# EasyEDA Pro project 14届省.epro

# Schematic B1

## Sheets
1 ETH: Create Date: 2024-04-08; Page Name: ETH; Project Name: Project; Schematic Name: B1; Update Date: 2024-04-08
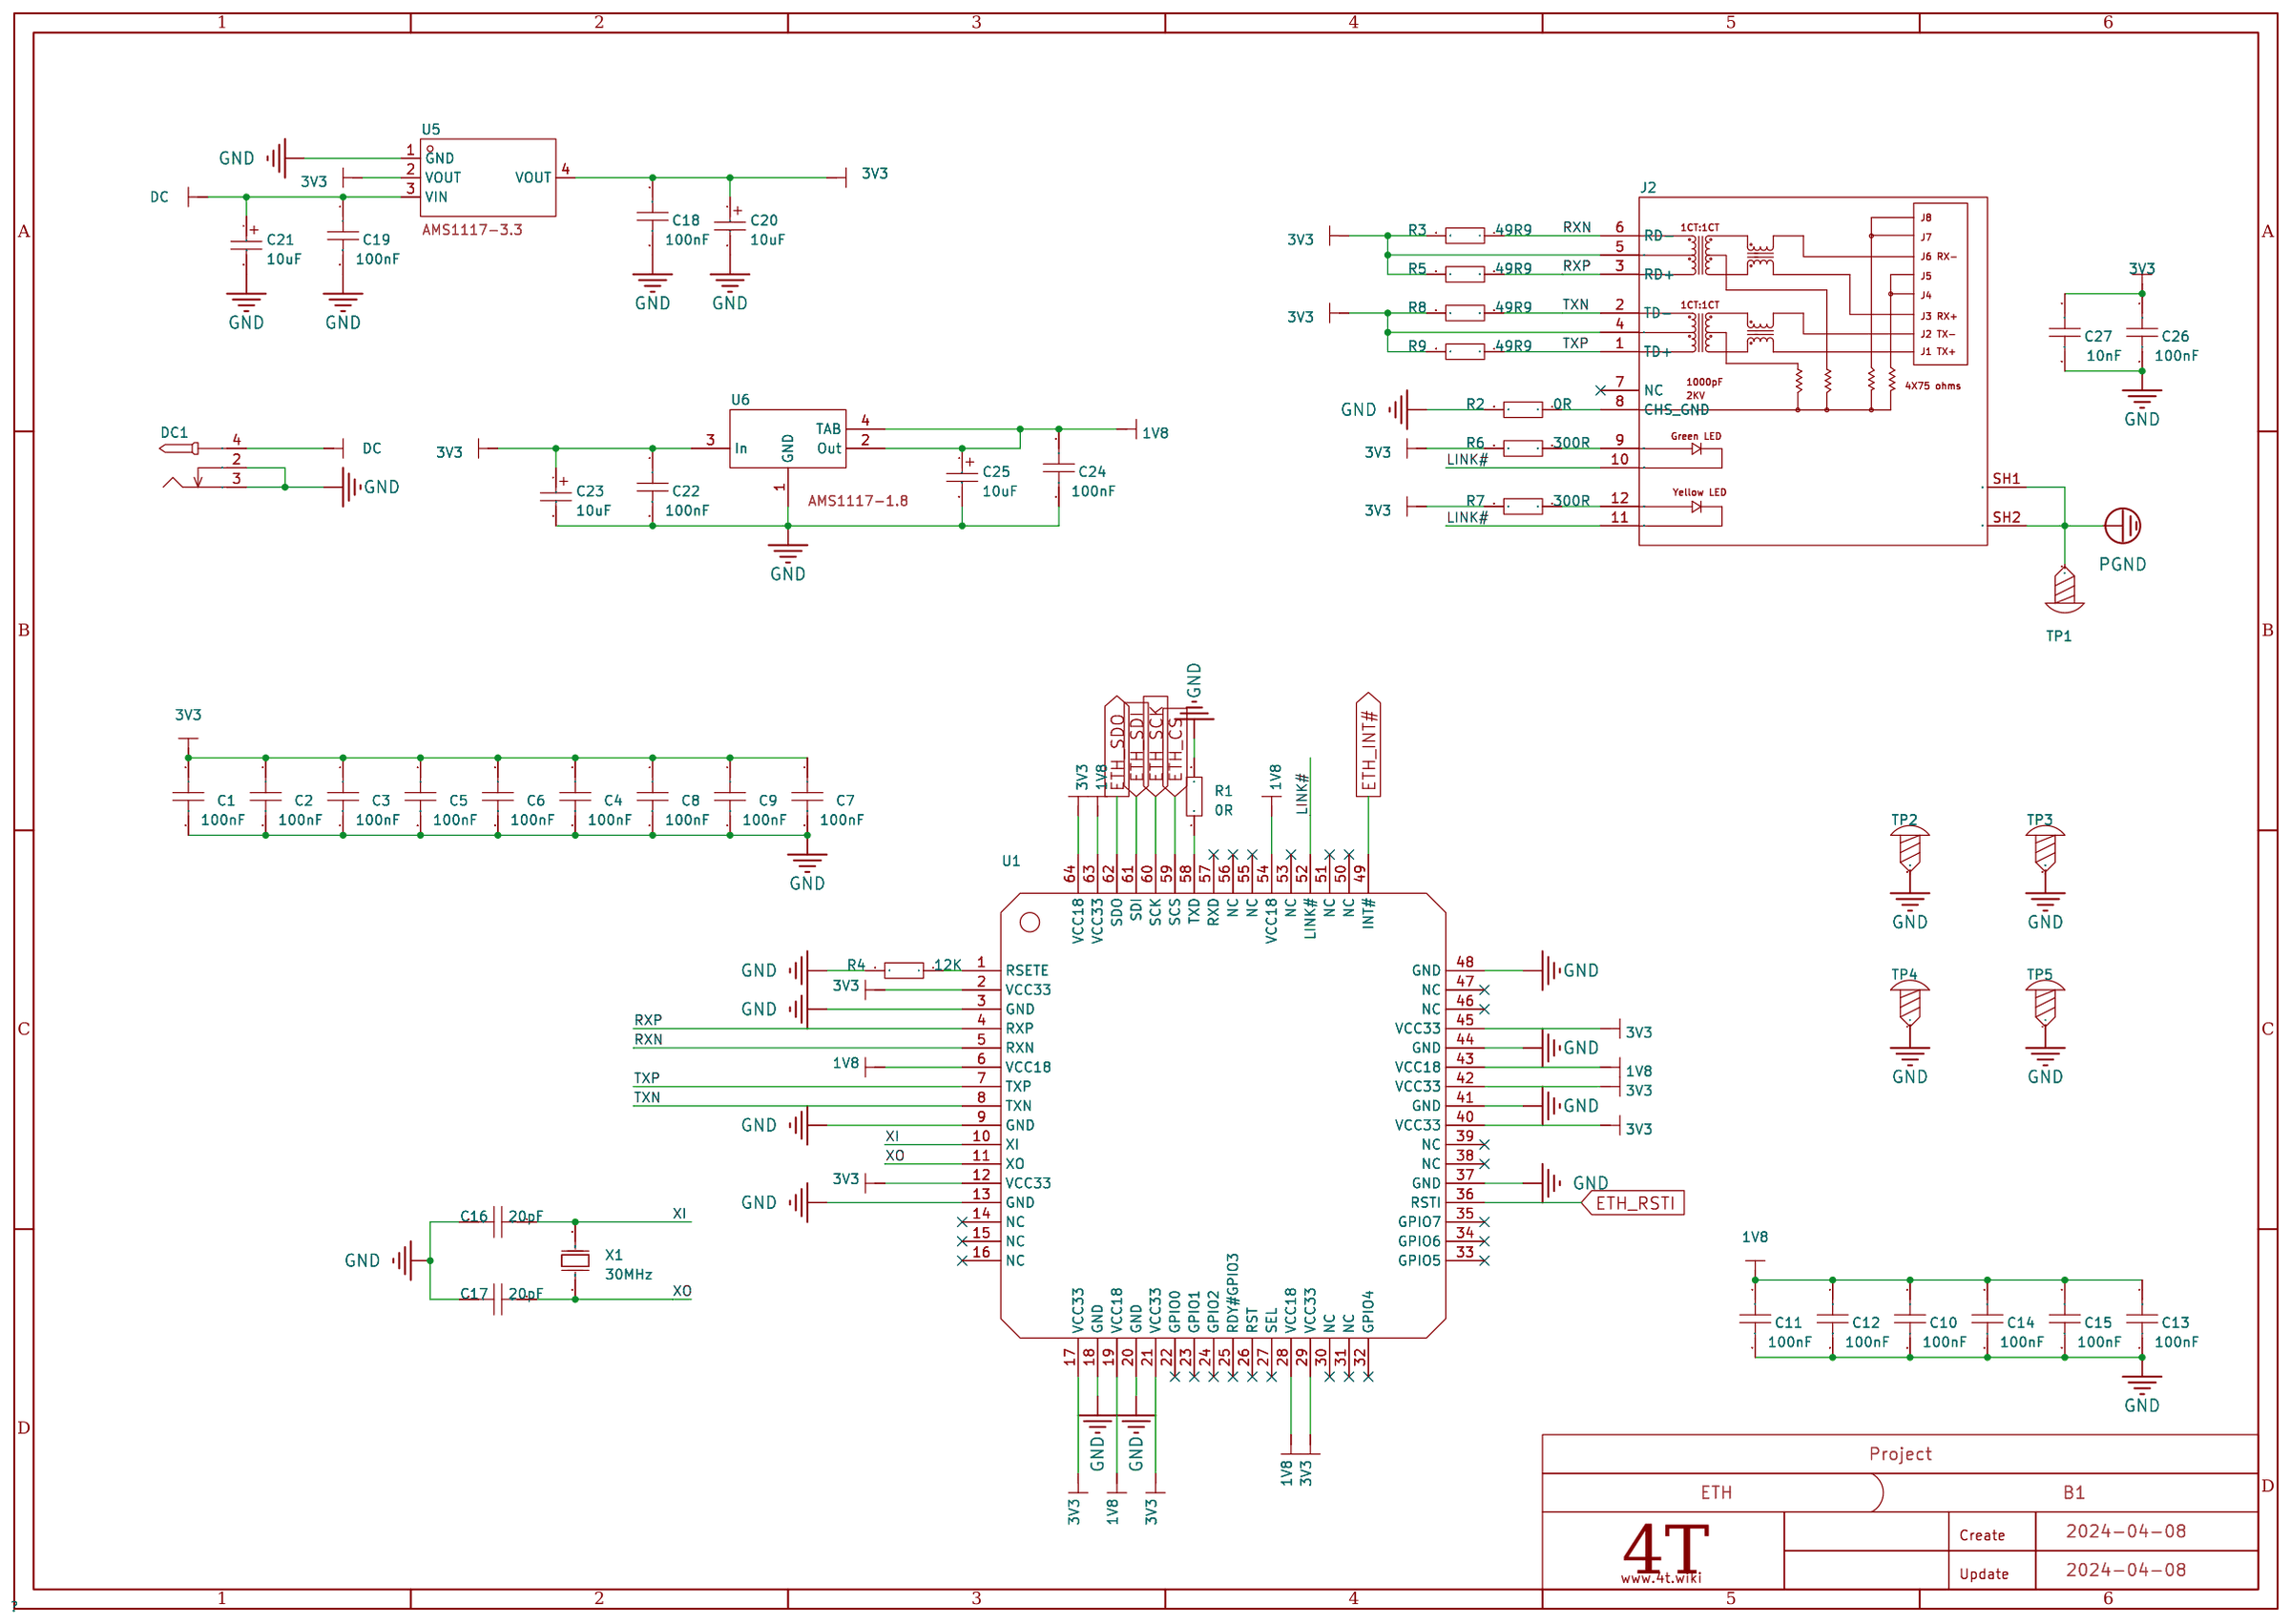
[diagram p0: ETH]
2 MP: Page Name: MP; Update Date: 2024-04-10
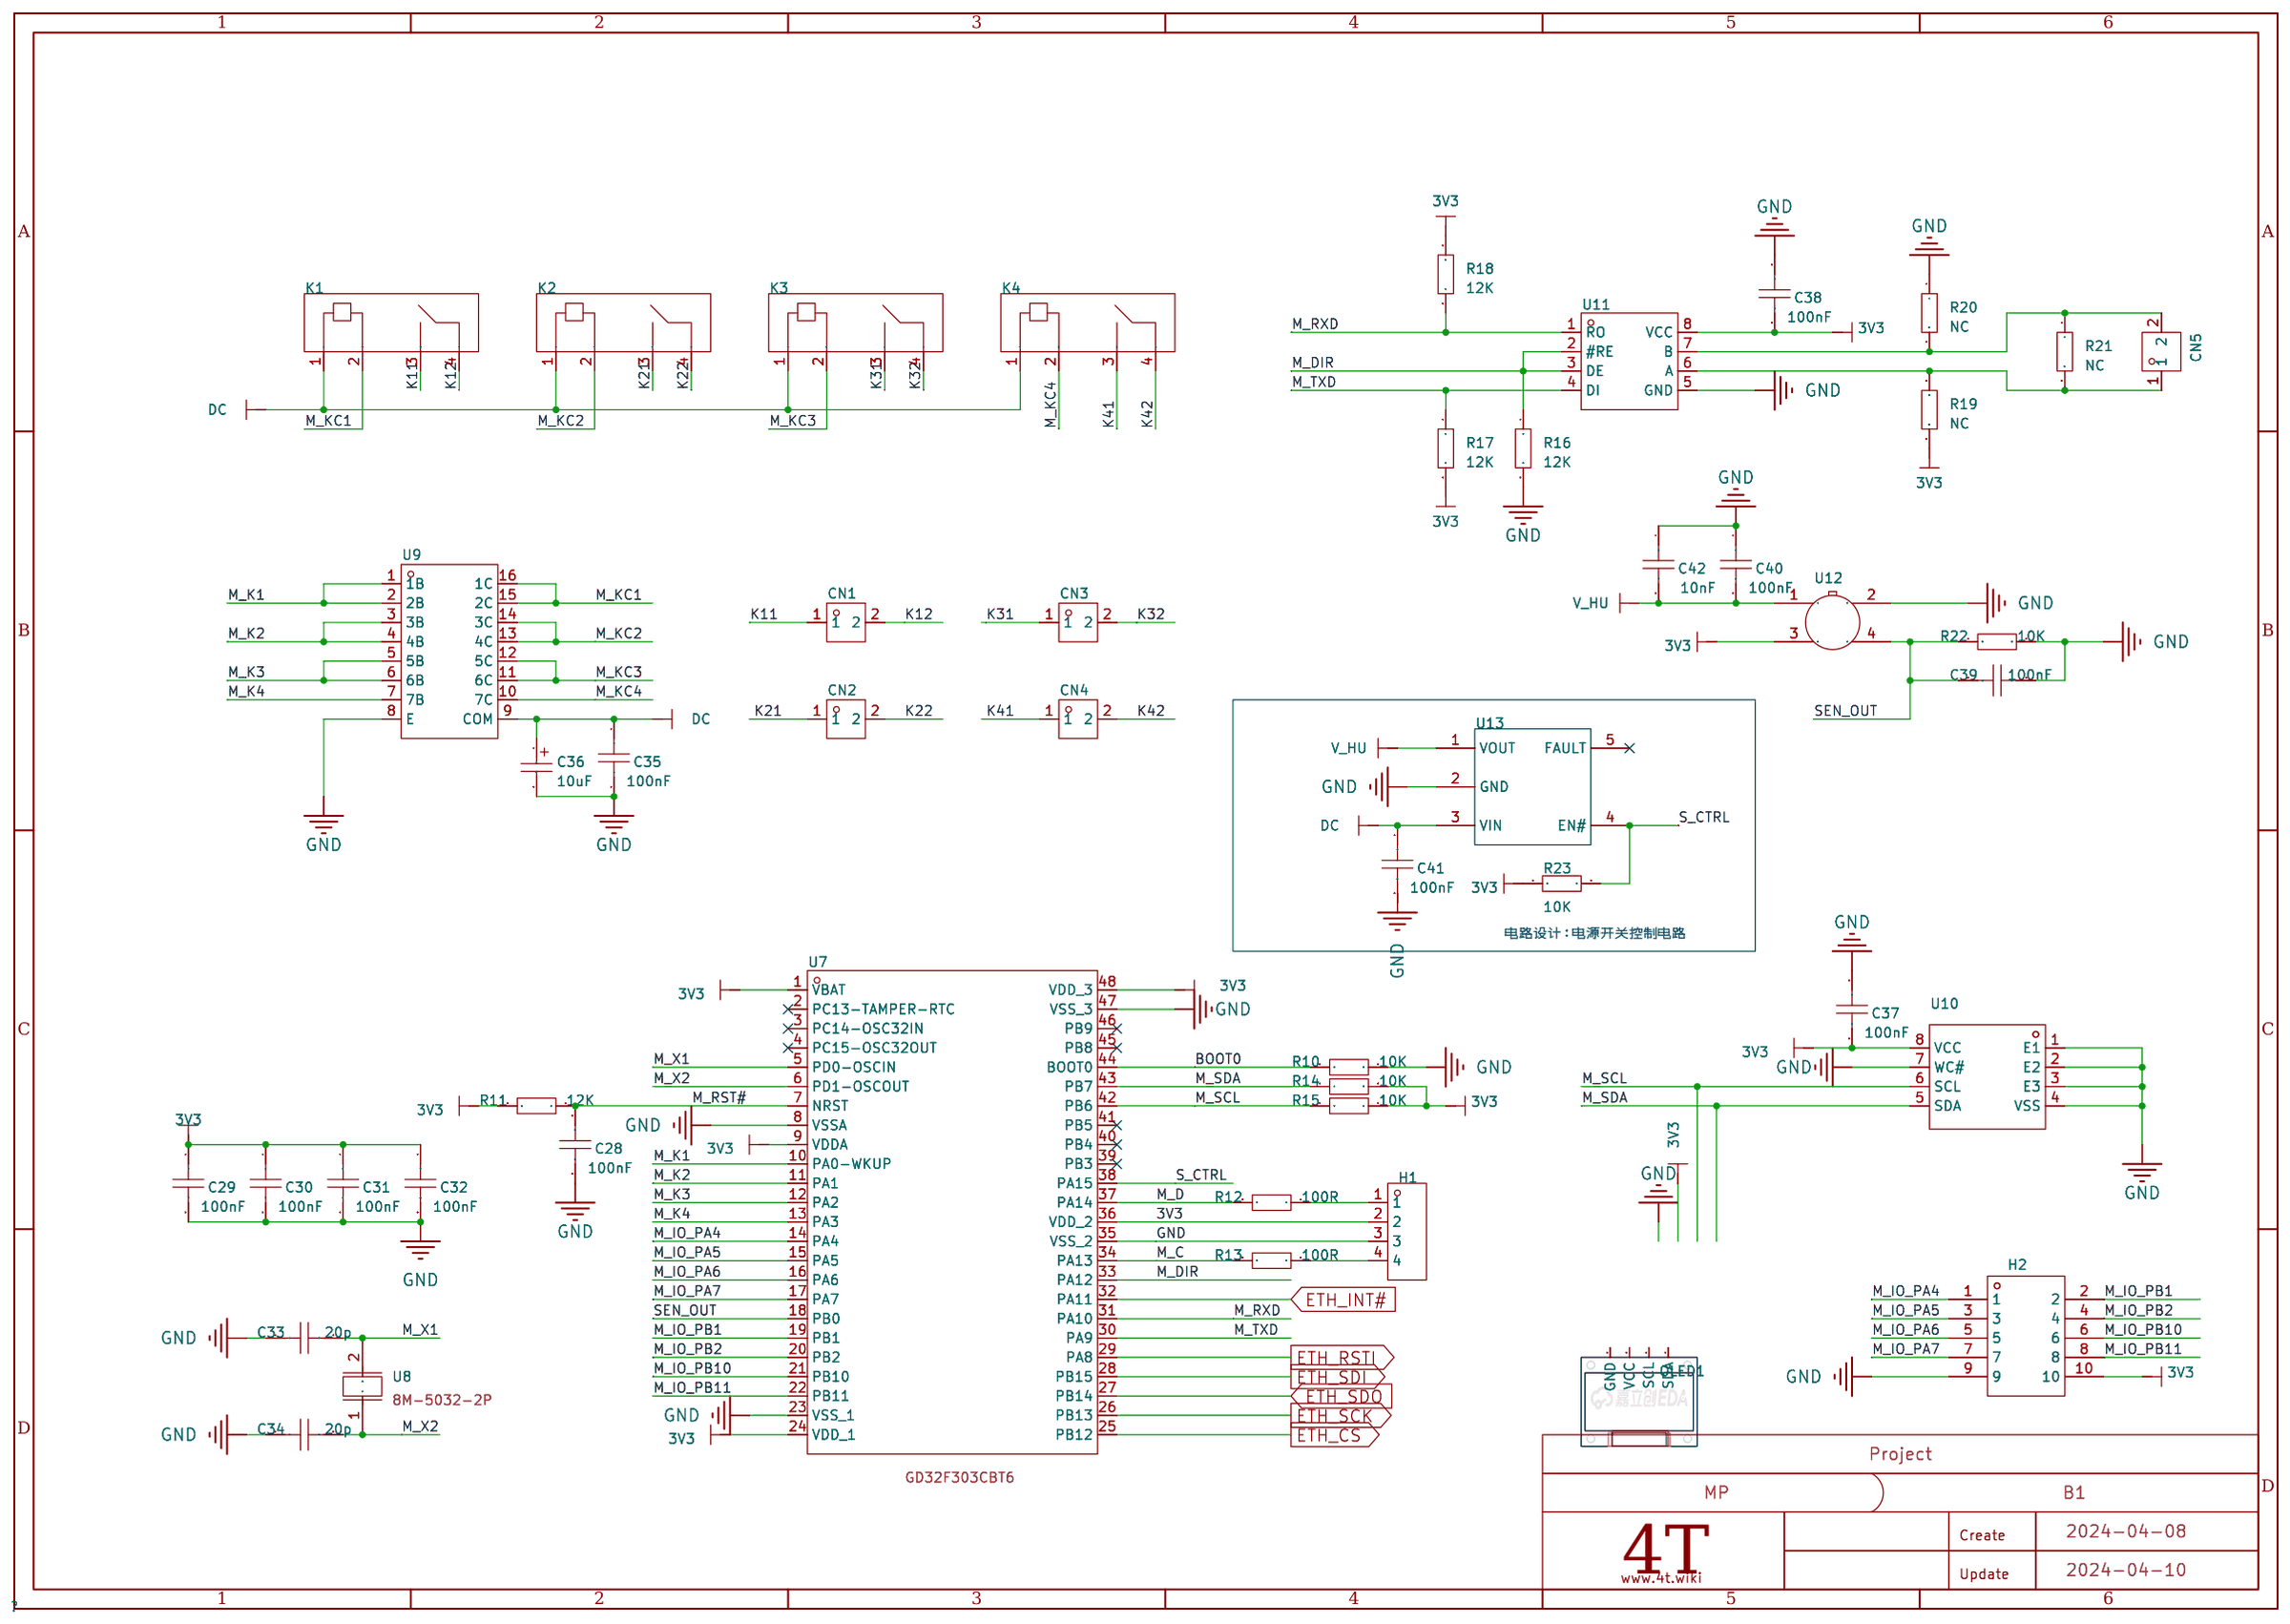
[diagram p1: MP]

## Parts
sheet ETH
C1  100nF  [C0805]
C2  100nF  [C0805]
C3  100nF  [C0805]
C4  100nF  [C0805]
C5  100nF  [C0805]
C6  100nF  [C0805]
C7  100nF  [C0805]
C8  100nF  [C0805]
C9  100nF  [C0805]
C10  100nF  [C0805]
C11  100nF  [C0805]
C12  100nF  [C0805]
C13  100nF  [C0805]
C14  100nF  [C0805]
C15  100nF  [C0805]
C16  20pF  [C0805]
C17  20pF  [C0805]
C18  100nF  [C0805]
C19  100nF  [C0805]
C20  10uF  [C_Ele_SMD_3x5.4mm]
C21  10uF  [C_Ele_SMD_3x5.4mm]
C22  100nF  [C0805]
C23  10uF  [C_Ele_SMD_3x5.4mm]
C24  100nF  [C0805]
C25  10uF  [C_Ele_SMD_3x5.4mm]
C26  100nF  [C0805]
C27  10nF  [C0805]
DC1  -  [DC-2.0]
J2  HY911105AE  [RJ45-TH_HR911105A]
R1  0R  [R0805]
R2  0R  [R0805]
R3  49R9  [R0805]
R4  12K  [R0805]
R5  49R9  [R0805]
R6  300R  [R0805]
R7  300R  [R0805]
R8  49R9  [R0805]
R9  49R9  [R0805]
TP1  -  [M3螺丝]
TP2  -  [M2螺丝]
TP3  -  [M2螺丝]
TP4  -  [M2螺丝]
TP5  -  [M2螺丝]
U1  CH395Q  [LQFP-64_L10.0-W10.0-P0.50-LS12.0-BL]
U5  AMS1117-3.3  [SOT-223-3_L6.5-W3.4-P2.30-LS7.0-BR]
U6  AMS1117-1.8  [SOT-223-4_L6.5-W3.5-P2.30-LS7.0-BR]
X1  30MHz  [OSC-SMD_L5.0-W3.2]
sheet MP
C28  100nF  [C0805]
C29  100nF  [C0805]
C30  100nF  [C0805]
C31  100nF  [C0805]
C32  100nF  [C0805]
C33  20p  [C0805]
C34  20p  [C0805]
C35  100nF  [C0805]
C36  10uF  [C_Ele_SMD_3x5.4mm]
C37  100nF  [C0805]
C38  100nF  [C0805]
C39  100nF  [C0805]
C40  100nF  [C0805]
C41  100nF  [C0805]
C42  10nF  [C0805]
CN1  KF128L-5.08-2P 蓝色  [TH_KF128L-5.08-2P]
CN2  KF128L-5.08-2P 蓝色  [TH_KF128L-5.08-2P]
CN3  KF128L-5.08-2P 蓝色  [TH_KF128L-5.08-2P]
CN4  KF128L-5.08-2P 蓝色  [TH_KF128L-5.08-2P]
CN5  KF128L-5.08-2P 蓝色  [TH_KF128L-5.08-2P]
H1  -  [HDR-TH_4P-P2.54-V-F]
H2  -  [HDR-TH_10P-P2.54-V-M-R2-C5-S2.54]
K1  HF49FD/012-1H12  [RELAY-TH_HF49FD-XXX-1H12-XXX]
K2  HF49FD/012-1H12  [RELAY-TH_HF49FD-XXX-1H12-XXX]
K3  HF49FD/012-1H12  [RELAY-TH_HF49FD-XXX-1H12-XXX]
K4  HF49FD/012-1H12  [RELAY-TH_HF49FD-XXX-1H12-XXX]
OLED1  -  [0.96OLED_4P]
R10  10K  [R0805]
R11  12K  [R0805]
R12  100R  [R0805]
R13  100R  [R0805]
R14  10K  [R0805]
R15  10K  [R0805]
R16  12K  [R0805]
R17  12K  [R0805]
R18  12K  [R0805]
R19  NC  [R0805]
R20  NC  [R0805]
R21  NC  [R0805]
R22  10K  [R0805]
R23  10K  [R0805]
U7  GD32F303CBT6  [LQFP-48_L7.0-W7.0-P0.50-LS9.0-BL]
U8  8M-5032-2P  [CRYSTAL-SMD_L5.0-W3.2]
U9  ULN2003  [SOIC-16_L9.9-W3.9-P1.27-LS6.0-BL]
U10  M24C02-WMN6TP  [SOIC-8_L4.9-W3.9-P1.27-LS6.0-BL]
U11  MAX3485ESA  [SOP-8_L5.0-W4.0-P1.27-LS6.0-BL]
U12  MP-2  [SENSOR-TH_MP-5]
U13  -  [SOT_PDS]

## Library data of the parts
C1-C19 C22 C24 C26-C35 C37-C42 = CAP_0603: Supplier Footprint: 0603
C20 C21 C23 C25 C36 = C_Ele_SMD_3x5.4mm: Supplier Footprint: SMD,3x5.4mm
DC1 = DC-005_2.0: Supplier Footprint: 插件
J2 = HY911105AE: 连接器类型:RJ插座;USOC代码:RJ45;端口数量:1;等级:-;屏蔽:-;LED:-;; LCSC Part Name: RJ45 带变压器; Supplier Part: C69427; Manufacturer: HANRUN(汉仁); Supplier Footprint: 插件; JLCPCB Part Class: 扩展库; Datasheet: https://atta.szlcsc.com/upload/public/pdf/source/20160507/1462613611469.pdf; Supplier: LCSC; Connector Type: RJ插座; USOC Codes: RJ45; Number of Ports: 1
R1-R23 = Res_0805: Supplier Footprint: 0805
TP1 = M3螺丝: Supplier Footprint: 插件
TP2-TP5 = M2螺丝: Supplier Footprint: 插件
U1 = CH395Q: 应用功能:以太网控制器;通道数:-;接口类型:Parallel, SPI, UART;电源电压:1.65V~3.6V;电源电流:90mA;; Supplier Part: C87390; Manufacturer: WCH(南京沁恒); Supplier Footprint: LQFP-64(10x10); JLCPCB Part Class: 扩展库; Datasheet: https://atta.szlcsc.com/upload/public/pdf/source/20200903/C87390_2BA27438C515B4B897A780BE99160E01.pdf; Supplier: LCSC; Application Function: 以太网控制器; Interface: Parallel, SPI, UART; Supply Voltage: 1.65V~3.6V; Supply Current: 90mA
U5 = AMS1117-3.3_C6186: 输出类型:固定;输出极性:正;输出通道数:1;最大输入电压:-;输出电压:3.3V;压差:1.3V@(800mA);静态电流(地电流):-;输出电流:1A;电源纹波抑制比(PSRR):72dB@(120Hz);噪声:-;特性:-;工作温度:-;; LCSC Part Name: 正 Vout=3.3V 1A 72dB@(120Hz); Supplier Part: C6186; Manufacturer: AMS; Supplier Footprint: SOT-223-3; JLCPCB Part Class: 基础库; Datasheet: https://atta.szlcsc.com/upload/public/pdf/source/20180727/C6186_7A095716F0823C02F1997A905E26C086.pdf; Supplier: LCSC; Output Type: 固定; Output Polarity: 正; Number of Outputs: 1; Output Voltage: 3.3V; Dropout Voltage: 1.3V@(800mA); Output Current: 1A; Power Supply Rejection Ratio (PSRR): 72dB@(120Hz)
U6 = AMS1117-1.8_C6185: 输出类型:固定;输出极性:正;输出通道数:1;最大输入电压:15V;输出电压:1.8V~1.8V;压差:1.3V@(1A);输出电流:1A;电源纹波抑制比(PSRR):75dB@(120Hz);; LCSC Part Name: 正 Vin=15V Vout=1.8V~1.8V 1A 75dB@(120Hz); Supplier Part: C6185; Manufacturer: AMS; Supplier Footprint: SOT-223-4; JLCPCB Part Class: 扩展库; Datasheet: https://atta.szlcsc.com/upload/public/pdf/source/20180727/C6186_7A095716F0823C02F1997A905E26C086.pdf; Supplier: LCSC; Output Type: 固定; Output Polarity: 正; Number of Outputs: 1; Maximum Input Voltage: 15V; Output Voltage: 1.8V~1.8V; Dropout Voltage: 1.3V@(1A); Output Current: 1A; Power Supply Rejection Ratio (PSRR): 75dB@(120Hz)
X1 = X503230MSB2GI: 晶振类型:贴片无源晶振;频率:30MHz;频率公差:±10ppm;频率稳定度:±50ppm;负载电容:20pF;工作温度:-40℃~+85℃;; LCSC Part Name: YSX530GA 30MHz ±10ppm 20pF; Supplier Part: C112563; Manufacturer: YXC(扬兴晶振); Supplier Footprint: SMD5032-2P; JLCPCB Part Class: 扩展库; Datasheet: https://atta.szlcsc.com/upload/public/pdf/source/20210329/C112559_847D3CACBA33ACCEB57DEA3AEBB187A1.pdf; Supplier: LCSC; Crystal Type: 贴片无源晶振; Frequency Tolerance: ±10ppm; Frequency Stability: ±50ppm; Load Capacitance: 20pF; Operating Temperature: -40℃~+85℃
CN1-CN5 = KF128L-5.08-2P 蓝色: Supplier Part: C2916931; Supplier Footprint: 5.08-2P; JLCPCB Part Class: 扩展库; Supplier: LCSC
H1 = HDR-F_2.54_1x4P: Supplier Part: C2718488; Supplier Footprint: 插件
H2 = HDR-M_2.54_2x5: Supplier Part: C124387; Supplier Footprint: 插件,P=2.54mm
K1-K4 = HF49FD/012-1H12: 线圈电压:12V;线圈类型:非极化-单线圈;触点形式:一组常开:1A(单刀单掷-常开);最大切换电流:5A;触点材料:AgNi;; LCSC Part Name: 宏发继电器; Supplier Part: C399491; Manufacturer: HF(宏发); Supplier Footprint: SIP-4; JLCPCB Part Class: 扩展库; Datasheet: https://atta.szlcsc.com/upload/public/pdf/source/20190620/C399491_B2190B02DDD565265172868420E7880D.pdf; Supplier: LCSC; Coil Voltage: 12V; Coil Type: 非极化-单线圈; Pin Number: 4; Contact Form: 一组常开:1A(单刀单掷-常开); Maximum Switching Current: 5A; Maximum Switching Voltage: 250V@AC；30V@DC; Coil Rated Power: 120mW; Contact Rating: 5A@30VDC；5A@250VAC; Coil Resistance: 1.2kΩ; Operate Time: 10ms; Release Time: 5ms; Contact Resistance: 100mΩ; Contact Material: AgNi; Operating Temperature: -40℃~+85℃
OLED1 = 0.96OLED模块_4P: Supplier Footprint: 插件
U7 = GD32F303CBT6_C3013779: CPU内核:ARM Cortex-M4;CPU最大主频:120MHz;工作电压范围:-;程序存储容量:128KB;RAM总容量:32KB;EEPROM/数据 FLASH容量:128KB;GPIO端口数量:37;ADC(位数):12bit;DAC(位数):12bit;(E)PWM(位数):-;8位Timer数量:-;16位Timer数量:7;32位Timer数量:-;CAN路数:1;U(S)ART路数:3;I2C路数:2;I2S路数:2;(Q)SPI路数:3;外设/功能:看门狗；RTC实时时钟;内部振荡器:; LCSC Part Name: ARM Cortex-M4 120MHz; Supplier Part: C3013779; Manufacturer: GigaDevice(兆易创新); Supplier Footprint: LQFP-48(7x7); JLCPCB Part Class: 扩展库; Datasheet: https://atta.szlcsc.com/upload/public/pdf/source/20220624/E1A57ED816B162D6D1424864911A792F.pdf; Supplier: LCSC; CPU Core: ARM Cortex-M4; CPU Maximum Speed: 120MHz; Program Storage Size: 128KB; Program Memory Type: FLASH; RAM Size: 32KB; EEPROM: 128KB; GPIO Ports Number: 37; ADC (Bit): 12bit; DAC (Bit): 12bit; 16Bit Timer: 7; CAN: 1; UART/USART: 3; I2C: 2; I2S: 2; SPI: 3; Peripheral/Function: 看门狗；RTC实时时钟; Watchdog: 有; Real-Time Clock: 有
U8 = 8M-5032-2P: Supplier Part: C9900017580; Supplier Footprint: 8MHz; JLCPCB Part Class: 扩展库; Supplier: LCSC
U9 = ULN2003: 开态输入电压(VI(on)@Vce,Ic):3V@2V,300mA;集射极饱和压降(VCE(sat)@Ii,Ic):1.2V@500uA,350mA;输出漏电流(Icex@Vce):50uA@50V;开态输入电流(Ii@Vi):-;关态输入电流(Ii(off)@Vce,Ic):65uA@50V,500uA;嵌位二极管漏电流(IR@VR):50uA@50V;嵌位二极管正向压降(VF@IF):1.7V@350mA;输入电容(Ci):15pF;工作温度:-20℃~+85℃;; Supplier Part: C688859; Manufacturer: IDCHIP(英锐芯); Supplier Footprint: SOIC-16; JLCPCB Part Class: 扩展库; Datasheet: https://atta.szlcsc.com/upload/public/pdf/source/20210302/C688859_5C67C6CBB0EA78EF92AFC966B53E1AD0.pdf; Supplier: LCSC; ON-state input   voltage(VI(on)@Vce,Ic): 3V@2V,300mA; Collector-emitter   saturation voltage (VCE(sat)@Ii,Ic): 1.2V@500uA,350mA; Output leakage current (Icex@Vce): 50uA@50V; Off-state input current (Ii(off)@Vce,Ic): 65uA@50V,500uA; Clamp Diode Leakage Current (IR@VR): 50uA@50V; Clamp Diode Forward Voltage (VF@IF): 1.7V@350mA; Input Capacitance (Ci): 15pF; Operating Temperature: -20℃~+85℃
U10 = M24C02-WMN6TP: 2-Kbit(256 x 8bit)，I2C接口，工作电压：2.5V to 5.5V; Supplier Part: C7562; Manufacturer: ST(意法半导体); Supplier Footprint: SOIC-8; JLCPCB Part Class: 基础库; Datasheet: https://atta.szlcsc.com/upload/public/pdf/source/20140724/1457707167301.pdf; Supplier: LCSC
U11 = MAX3485ESA: Supplier Part: C668204; Manufacturer: UMW(广东友台半导体); Supplier Footprint: SOP-8; JLCPCB Part Class: 扩展库; Datasheet: https://atta.szlcsc.com/upload/public/pdf/source/20221009/BC018EFD0F414E24649E284F574E449C.pdf; Supplier: LCSC
U12 = MP-2: Supplier Part: C242497; Manufacturer: Winsen(炜盛); Supplier Footprint: 插件; JLCPCB Part Class: 扩展库; Datasheet: https://atta.szlcsc.com/upload/public/pdf/source/20180704/C242497_B8D2418C2743DA3210851F2FB82DA8BD.pdf; Supplier: LCSC
U13 = PDS

## Nets
1V8: C10.1 C11.1 C12.1 C13.1 C14.1 C15.1 C24.1 C25.1 U1.6(VCC18) U1.19(VCC18) U1.28(VCC18) U1.43(VCC18) U1.54(VCC18) U1.63(VCC33) U6.2(Out) U6.4(TAB)
3V3: C1.1 C2.1 C3.1 C4.1 C5.1 C6.1 C7.1 C8.1 C9.1 C18.1 C20.1 C22.1 C23.1 C26.1 C27.1 C29.1 C30.1 C31.1 C32.1 C37.2 C38.2 H1.2 H2.10 J2.4 J2.5 R3.2 R5.2 R6.2 R7.2 R8.2 R9.2 R11.2 R14.2 R15.1 R17.2 R18.1 R19.2 R23.1 U1.2(VCC33) U1.12(VCC33) U1.17(VCC33) U1.21(VCC33) U1.29(VCC33) U1.40(VCC33) U1.42(VCC33) U1.45(VCC33) U1.64(VCC18) U5.2(VOUT) U5.4(VOUT) U6.3(In) U7.1(VBAT) U7.9(VDDA) U7.24(VDD_1) U7.36(VDD_2) U7.48(VDD_3) U10.8(VCC) U11.8(VCC) U12.3
GND: C1.2 C2.2 C3.2 C4.2 C5.2 C6.2 C7.2 C8.2 C9.2 C10.2 C11.2 C12.2 C13.2 C14.2 C15.2 C16.1 C17.1 C18.2 C19.2 C20.2 C21.2 C22.2 C23.2 C24.2 C25.2 C26.2 C27.2 C28.2 C29.2 C30.2 C31.2 C32.2 C33.1 C34.1 C35.2 C36.2 C37.1 C38.1 C39.2 C40.1 C41.2 C42.1 DC1.2 DC1.3 H1.3 H2.9 R1.2 R2.2 R4.2 R10.1 R16.2 R20.1 R22.2 TP2.1 TP3.1 TP4.1 TP5.1 U1.3(GND) U1.9(GND) U1.13(GND) U1.18(GND) U1.20(GND) U1.37(GND) U1.41(GND) U1.44(GND) U1.48(GND) U5.1(GND) U6.1(GND) U7.8(VSSA) U7.23(VSS_1) U7.35(VSS_2) U7.47(VSS_3) U9.8(E) U10.1(E1) U10.2(E2) U10.3(E3) U10.4(VSS) U10.7(WC#) U11.5(GND) U12.2 U13.2(GND)
PGND: J2.SH1 J2.SH2 TP1.1
BOOT0: R10.2 U7.44(BOOT0)
DC: C19.1 C21.1 C35.1 C36.1 C41.1 DC1.4 K1.1 K2.1 K3.1 K4.1 U5.3(VIN) U9.9(COM) U13.3(VIN)
ETH_CS: U1.59(SCS) U7.25(PB12)
ETH_INT#: U1.49(INT#) U7.32(PA11)
ETH_RSTI: U1.36(RSTI) U7.29(PA8)
ETH_SCK: U1.60(SCK) U7.26(PB13)
ETH_SDI: U1.61(SDI) U7.28(PB15)
ETH_SDO: U1.62(SDO) U7.27(PB14)
K11: CN1.1 K1.3
K12: CN1.2 K1.4
K21: CN2.1 K2.3
K22: CN2.2 K2.4
K31: CN3.1 K3.3
K32: CN3.2 K3.4
K41: CN4.1 K4.3
K42: CN4.2 K4.4
LINK#: J2.10 J2.11 U1.52(LINK#)
M_C: R13.2 U7.34(PA13)
M_D: R12.2 U7.37(PA14)
M_DIR: R16.1 U7.33(PA12) U11.2(#RE) U11.3(DE)
M_IO_PA4: H2.1 U7.14(PA4)
M_IO_PA5: H2.3 U7.15(PA5)
M_IO_PA6: H2.5 U7.16(PA6)
M_IO_PA7: H2.7 U7.17(PA7)
M_IO_PB1: H2.2 U7.19(PB1)
M_IO_PB2: H2.4 U7.20(PB2)
M_IO_PB10: H2.6 U7.21(PB10)
M_IO_PB11: H2.8 U7.22(PB11)
M_K1: U7.10(PA0-WKUP) U9.1(1B) U9.2(2B)
M_K2: U7.11(PA1) U9.3(3B) U9.4(4B)
M_K3: U7.12(PA2) U9.5(5B) U9.6(6B)
M_K4: U7.13(PA3) U9.7(7B)
M_KC1: K1.2 U9.15(2C) U9.16(1C)
M_KC2: K2.2 U9.13(4C) U9.14(3C)
M_KC3: K3.2 U9.11(6C) U9.12(5C)
M_KC4: K4.2 U9.10(7C)
M_RST#: C28.1 R11.1 U7.7(NRST)
M_RXD: R18.2 U7.31(PA10) U11.1(RO)
M_SCL: R15.2 U7.42(PB6) U10.6(SCL)
M_SDA: R14.1 U7.43(PB7) U10.5(SDA)
M_TXD: R17.1 U7.30(PA9) U11.4(DI)
M_X1: C33.2 U7.5(PD0-OSCIN) U8.2
M_X2: C34.2 U7.6(PD1-OSCOUT) U8.1
RXN: J2.6(RD-) R3.1 U1.5(RXN)
RXP: J2.3(RD+) R5.1 U1.4(RXP)
S_CTRL: R23.2 U7.38(PA15) U13.4(EN#)
SEN_OUT: C39.1 R22.1 U7.18(PB0) U12.4
TXN: J2.2(TD-) R8.1 U1.8(TXN)
TXP: J2.1(TD+) R9.1 U1.7(TXP)
V_HU: C40.2 C42.2 U12.1 U13.1(VOUT)
XI: C16.2 U1.10(XI) X1.2(OSC2)
XO: C17.2 U1.11(XO) X1.1(OSC1)
$1N6890: R4.1 U1.1(RSETE)
$1N7627: R1.1 U1.58(TXD)
$1N10654: J2.8(CHS GND) R2.1
$1N10919: J2.12 R7.1
$1N10952: J2.9 R6.1
$2N5291: H1.1 R12.1
$2N5344: H1.4 R13.1
$2N14954: CN5.2 R20.2 R21.1 U11.7(B)
$2N14989: CN5.1 R19.1 R21.2 U11.6(A)

Not connected (* = marked no-connect by the designer): J2 7(NC)*; OLED1 1(GND) 2(VCC) 3(SCL) 4(SDA); U1 14(NC)* 15(NC)* 16(NC)* 22(GPIO0)* 23(GPIO1)* 24(GPIO2)* 25(RDY#GPIO3)* 26(RST)* 27(SEL)* 30(NC)* 31(NC)* 32(GPIO4)* 33(GPIO5)* 34(GPIO6)* 35(GPIO7)* 38(NC)* 39(NC)* 46(NC)* 47(NC)* 50(NC)* 51(NC)* 53(NC)* 55(NC)* 56(NC)* 57(RXD)*; U7 2(PC13-TAMPER-RTC)* 3(PC14-OSC32IN)* 4(PC15-OSC32OUT)* 39(PB3)* 40(PB4)* 41(PB5)* 45(PB8)* 46(PB9)*; U13 5(FAULT)*

## Notes on the sheets
sheet 2
- 电路设计：电源开关控制电路

# Board B1
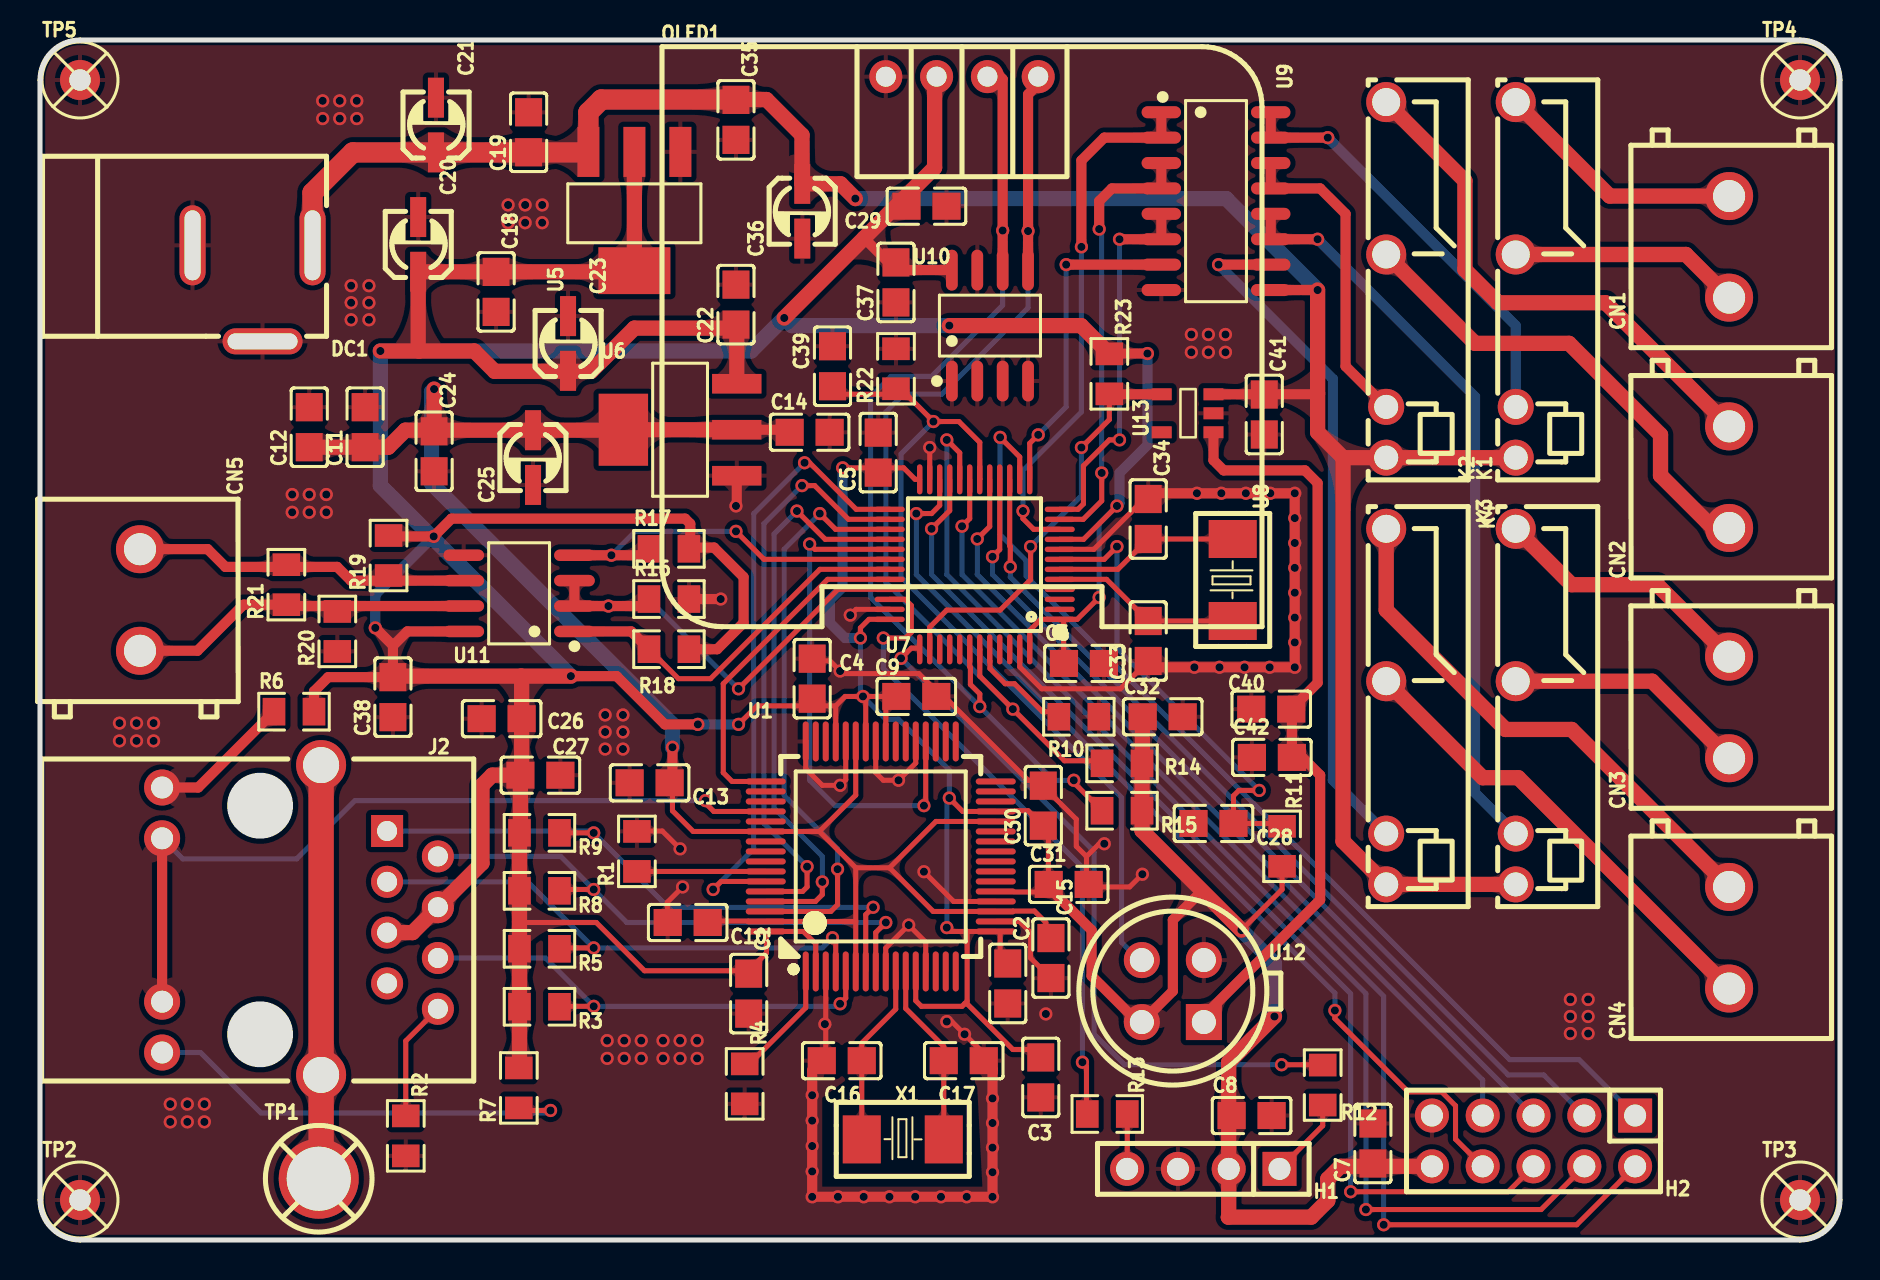
[diagram p2: board, top side]
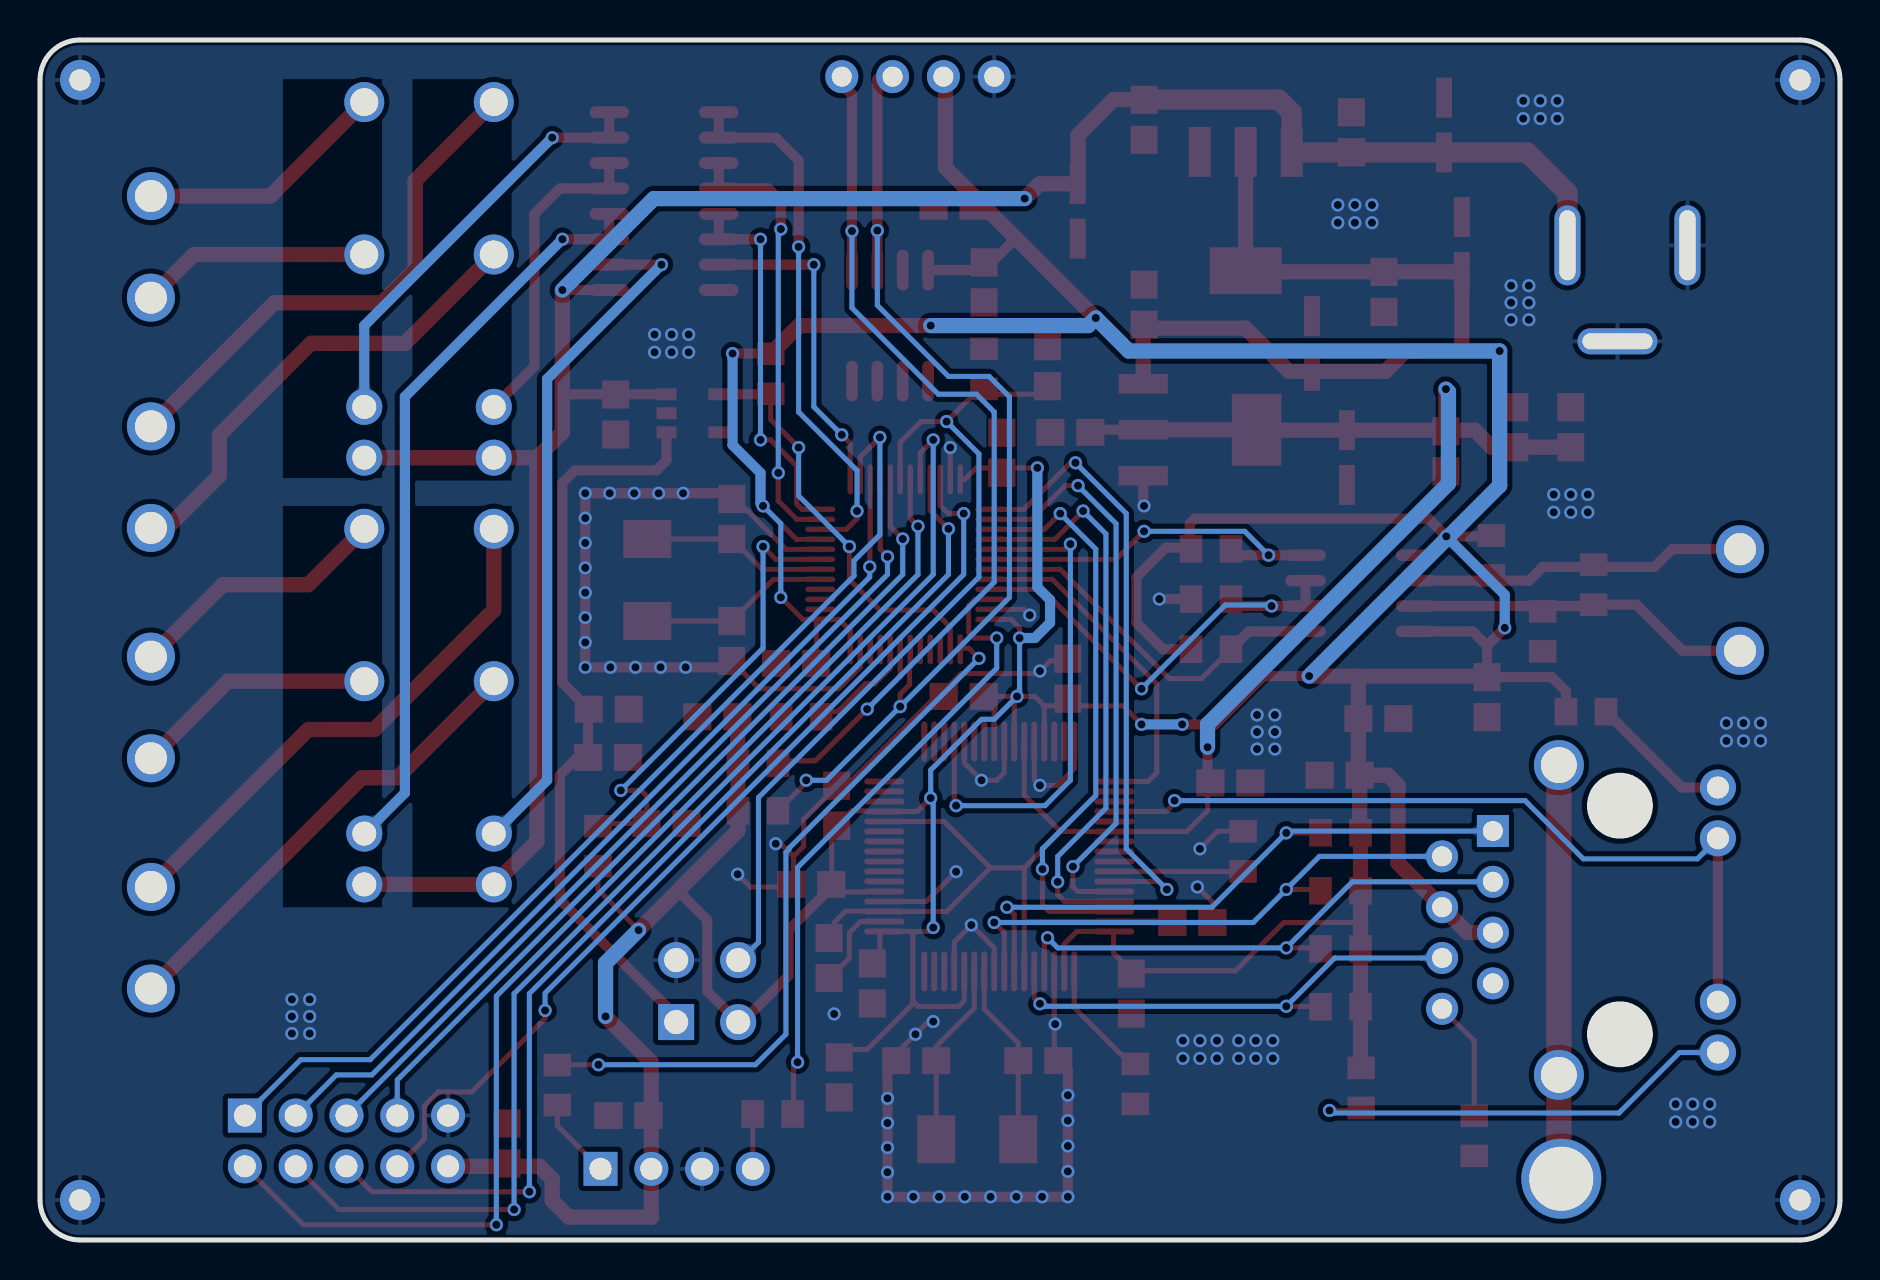
[diagram p3: board, bottom side, seen from below]

Outline 90 x 60 mm; copper layers: Top Layer, Bottom Layer. Coordinates in mm from the lower left corner of the outline.
Outline path: 0,58 0,2 arc(0.59,0.59) 2,0 88,0 arc(89.41,0.59) 90,2 90,58 arc(89.41,59.41) 88,60 2,60 arc(0.59,59.41) 0,58
Stack: Top Layer 0.035mm / Dielectric1 1.51mm FR4 er 4.5 / Bottom Layer 0.035mm

## Design rules (mm)
net XO: DP1
net XI: DP1
net M_X1: DP2
net M_X2: DP2
template: 用户自定义配置
spacing safeClearance (default): track to track 0.203, other pairs 0.152 to 0.3
track width trackWidth (default): min 0.254, default 0.254, max 2.54
differential pair differentialPair (default): width min 0.127, default 0.254, max 2.54; gap min 0.152, default 0.152
via viaSize (default): diameter min 0.635, default 0.66, max 10; hole min 0.381, default 0.406, max 5.999

## Placement (name value [footprint] x y rotation side)
C1  100nF  [C0805]  35.43 12.32 270 top
C2  100nF  [C0805]  48.39 12.83 270 top
C3  100nF  [C0805]  50.04 8.13 270 top
C4  100nF  [C0805]  38.61 28.07 90 top
C5  100nF  [C0805]  41.91 39.37 90 top
C6  100nF  [C0805]  52.2 28.83 0 top
C7  100nF  [C0805]  66.64 4.83 90 top
C8  100nF  [C0805]  60.58 6.22 0 top
C9  100nF  [C0805]  43.81 27.18 0 top
C10  100nF  [C0805]  32.38 15.88 180 top
C11  100nF  [C0805]  16.26 40.64 90 top
C12  100nF  [C0805]  13.46 40.64 90 top
C13  100nF  [C0805]  30.48 22.86 180 top
C14  100nF  [C0805]  38.48 40.39 0 top
C15  100nF  [C0805]  50.55 14.1 270 top
C16  20pF  [C0805]  40.09 8.97 0 top
C17  20pF  [C0805]  46.19 8.97 180 top
C18  100nF  [C0805]  22.81 47.41 270 top
C19  100nF  [C0805]  24.43 55.39 90 top
C20  10uF  [C_Ele_SMD_3x5.4mm]  18.92 49.78 270 top
C21  10uF  [C_Ele_SMD_3x5.4mm]  19.81 55.75 270 top
C22  100nF  [C0805]  34.8 46.77 90 top
C23  10uF  [C_Ele_SMD_3x5.4mm]  26.42 44.83 270 top
C24  100nF  [C0805]  19.7 39.44 270 top
C25  10uF  [C_Ele_SMD_3x5.4mm]  24.64 39.12 90 top
C26  100nF  [C0805]  23.08 26.07 180 top
C27  10nF  [C0805]  25.02 23.24 0 top
C28  100nF  [C0805]  58.67 20.83 180 top
C29  100nF  [C0805]  44.32 51.69 0 top
C30  100nF  [C0805]  50.16 21.72 90 top
C31  100nF  [C0805]  51.44 17.78 0 top
C32  100nF  [C0805]  56.13 26.16 0 top
C33  20p  [C0805]  55.41 29.95 90 top
C34  20p  [C0805]  55.41 36.05 270 top
C35  100nF  [C0805]  34.8 56.01 270 top
C36  10uF  [C_Ele_SMD_3x5.4mm]  38.1 51.44 90 top
C37  100nF  [C0805]  42.8 47.88 90 top
C38  100nF  [C0805]  17.65 27.14 90 top
C39  100nF  [C0805]  39.62 43.69 90 top
C40  100nF  [C0805]  61.56 26.54 0 top
C41  100nF  [C0805]  61.21 41.28 270 top
C42  10nF  [C0805]  61.59 24.13 0 top
CN1  KF128L-5.08-2P 蓝色  [TH_KF128L-5.08-2P]  84.46 49.66 90 top
CN2  KF128L-5.08-2P 蓝色  [TH_KF128L-5.08-2P]  84.46 38.14 90 top
CN3  KF128L-5.08-2P 蓝色  [TH_KF128L-5.08-2P]  84.46 26.63 90 top
CN4  KF128L-5.08-2P 蓝色  [TH_KF128L-5.08-2P]  84.46 15.11 90 top
CN5  KF128L-5.08-2P 蓝色  [TH_KF128L-5.08-2P]  5 32 270 top
DC1  -  [DC-2.0]  10.5 50 180 top
H1  -  [HDR-TH_4P-P2.54-V-F]  58.17 3.56 180 top
H2  -  [HDR-TH_10P-P2.54-V-M-R2-C5-S2.54]  74.68 4.95 180 top
J2  HY911105AE  [RJ45-TH_HR911105A]  13 16 270 top
K1  HF49FD/012-1H12  [RELAY-TH_HF49FD-XXX-1H12-XXX]  73.79 48.01 90 top
K2  HF49FD/012-1H12  [RELAY-TH_HF49FD-XXX-1H12-XXX]  67.31 48.01 90 top
K3  HF49FD/012-1H12  [RELAY-TH_HF49FD-XXX-1H12-XXX]  73.79 26.67 90 top
K4  HF49FD/012-1H12  [RELAY-TH_HF49FD-XXX-1H12-XXX]  67.31 26.67 90 top
OLED1  -  [0.96OLED_4P]  46.1 58.17 0 top
R1  0R  [R0805]  29.84 19.43 90 top
R2  0R  [R0805]  18.29 5.21 270 top
R3  49R9  [R0805]  24.97 11.66 180 top
R4  12K  [R0805]  35.23 7.81 270 top
R5  49R9  [R0805]  24.97 14.56 180 top
R6  300R  [R0805]  12.7 26.42 0 top
R7  300R  [R0805]  23.94 7.6 90 top
R8  49R9  [R0805]  24.97 17.46 180 top
R9  49R9  [R0805]  24.97 20.36 180 top
R10  10K  [R0805]  51.94 26.16 180 top
R11  12K  [R0805]  62.1 19.69 270 top
R12  100R  [R0805]  64.13 7.75 90 top
R13  100R  [R0805]  53.36 6.3 180 top
R14  10K  [R0805]  54.1 23.83 0 top
R15  10K  [R0805]  54.1 21.46 180 top
R16  12K  [R0805]  31.45 32.05 0 top
R17  12K  [R0805]  31.45 34.56 0 top
R18  12K  [R0805]  31.45 29.54 180 top
R19  NC  [R0805]  17.43 34.22 90 top
R20  NC  [R0805]  14.87 30.43 90 top
R21  NC  [R0805]  12.32 32.77 90 top
R22  10K  [R0805]  42.8 43.56 90 top
R23  10K  [R0805]  53.47 43.31 270 top
TP1  -  [M3螺丝]  14 3 0 top
TP2  -  [M2螺丝]  2 2 0 top
TP3  -  [M2螺丝]  88 2 0 top
TP4  -  [M2螺丝]  88 58 0 top
TP5  -  [M2螺丝]  2 58 0 top
U1  CH395Q  [LQFP-64_L10.0-W10.0-P0.50-LS12.0-BL]  42.04 19.18 0 top
U5  AMS1117-3.3  [SOT-223-3_L6.5-W3.4-P2.30-LS7.0-BR]  29.72 51.44 90 top
U6  AMS1117-1.8  [SOT-223-4_L6.5-W3.5-P2.30-LS7.0-BR]  32 40.51 0 top
U7  GD32F303CBT6  [LQFP-48_L7.0-W7.0-P0.50-LS9.0-BL]  46.74 33.78 90 top
U8  8M-5032-2P  [CRYSTAL-SMD_L5.0-W3.2]  59.63 33 270 top
U9  ULN2003  [SOIC-16_L9.9-W3.9-P1.27-LS6.0-BL]  58.8 51.94 270 top
U10  M24C02-WMN6TP  [SOIC-8_L4.9-W3.9-P1.27-LS6.0-BL]  47.5 45.72 0 top
U11  MAX3485ESA  [SOP-8_L5.0-W4.0-P1.27-LS6.0-BL]  23.95 32.33 90 top
U12  MP-2  [SENSOR-TH_MP-5]  56.64 12.45 90 top
U13  -  [SOT_PDS]  58.67 40.39 90 top
X1  30MHz  [OSC-SMD_L5.0-W3.2]  43.14 5.03 180 top

## Footprints (pads in the part's own frame, mm; a bottom-side part is the same pattern mirrored in y, then rotated)
0.96OLED_4P
  round 1.65 hole 1: 1(-3.81,-0.002) 2(-1.27,0.002) 3(1.27,0.002) 4(3.81,0.002)
C0805
  rect 1.41x1.35 smd: 1(-1,0) 2(1,0)
C_Ele_SMD_3x5.4mm
  rect 1.999x0.8 smd: 1(1.374,-0.014) 2(-1.364,-0.014)
CRYSTAL-SMD_L5.0-W3.2
  rect 1.9x2.4 smd: 1(-2.05,0) 2(2.05,0)
DC-2.0
  oval 4x1.3 hole 3.5x0.8: 2(-0.627,5.067)
  oval 1.3x4 hole 0.8x3.5: 3(2.873,0.267) 4(-3.127,0.267)
HDR-TH_4P-P2.54-V-F
  rect 1.7x1.7 hole 1.1: 1(-3.81,0)
  round 1.7 hole 1.1: 2(-1.27,0) 3(1.27,0) 4(3.81,0)
HDR-TH_10P-P2.54-V-M-R2-C5-S2.54
  rect 1.7x1.7 hole 1.1: 1(-5.08,-1.27)
  round 1.7 hole 1.1: 2(-5.08,1.27) 3(-2.54,-1.27) 4(-2.54,1.27) 5(0,-1.27) 6(0,1.27) 7(2.54,-1.27) 8(2.54,1.27) 9(5.08,-1.27) 10(5.08,1.27)
LQFP-48_L7.0-W7.0-P0.50-LS9.0-BL
  oval 0.27x1.5 smd: 1(-2.75,-4.25) 2(-2.25,-4.25) 3(-1.75,-4.25) 4(-1.25,-4.25) 5(-0.75,-4.25) 6(-0.25,-4.25) 7(0.25,-4.25) 8(0.75,-4.25) 9(1.25,-4.25) 10(1.75,-4.25) 11(2.25,-4.25) 12(2.75,-4.25) 25(2.75,4.25) 26(2.25,4.25) 27(1.75,4.25) 28(1.25,4.25) 29(0.75,4.25) 30(0.25,4.25) 31(-0.25,4.25) 32(-0.75,4.25) 33(-1.25,4.25) 34(-1.75,4.25) 35(-2.25,4.25) 36(-2.75,4.25)
  oval 1.5x0.27 smd: 13(4.25,-2.75) 14(4.25,-2.25) 15(4.25,-1.75) 16(4.25,-1.25) 17(4.25,-0.75) 18(4.25,-0.25) 19(4.25,0.25) 20(4.25,0.75) 21(4.25,1.25) 22(4.25,1.75) 23(4.25,2.25) 24(4.25,2.75) 37(-4.25,2.75) 38(-4.25,2.25) 39(-4.25,1.75) 40(-4.25,1.25) 41(-4.25,0.75) 42(-4.25,0.25) 43(-4.25,-0.25) 44(-4.25,-0.75) 45(-4.25,-1.25) 46(-4.25,-1.75) 47(-4.25,-2.25) 48(-4.25,-2.75)
LQFP-64_L10.0-W10.0-P0.50-LS12.0-BL
  oval 0.3x2 smd: 1(-3.75,-5.75) 2(-3.25,-5.75) 3(-2.75,-5.75) 4(-2.25,-5.75) 5(-1.75,-5.75) 6(-1.25,-5.75) 7(-0.75,-5.75) 8(-0.25,-5.75) 9(0.25,-5.75) 10(0.75,-5.75) 11(1.25,-5.75) 12(1.75,-5.75) 13(2.25,-5.75) 14(2.75,-5.75) 15(3.25,-5.75) 16(3.75,-5.75) 33(3.75,5.75) 34(3.25,5.75) 35(2.75,5.75) 36(2.25,5.75) 37(1.75,5.75) 38(1.25,5.75) 39(0.75,5.75) 40(0.25,5.75) 41(-0.25,5.75) 42(-0.75,5.75) 43(-1.25,5.75) 44(-1.75,5.75) 45(-2.25,5.75) 46(-2.75,5.75) 47(-3.25,5.75) 48(-3.75,5.75)
  oval 2x0.3 smd: 17(5.75,-3.75) 18(5.75,-3.25) 19(5.75,-2.75) 20(5.75,-2.25) 21(5.75,-1.75) 22(5.75,-1.25) 23(5.75,-0.75) 24(5.75,-0.25) 25(5.75,0.25) 26(5.75,0.75) 27(5.75,1.25) 28(5.75,1.75) 29(5.75,2.25) 30(5.75,2.75) 31(5.75,3.25) 32(5.75,3.75) 49(-5.75,3.75) 50(-5.75,3.25) 51(-5.75,2.75) 52(-5.75,2.25) 53(-5.75,1.75) 54(-5.75,1.25) 55(-5.75,0.75) 56(-5.75,0.25) 57(-5.75,-0.25) 58(-5.75,-0.75) 59(-5.75,-1.25) 60(-5.75,-1.75) 61(-5.75,-2.25) 62(-5.75,-2.75) 63(-5.75,-3.25) 64(-5.75,-3.75)
M2螺丝
  round 2 hole 1.07: 1(0,0)
M3螺丝
  round 4 hole 3.2: 1(-0.064,0.064)
OSC-SMD_L5.0-W3.2
  rect 1.9x2.4 smd: 1(-2.05,0) 2(2.05,0)
R0805
  rect 1.133x1.377 smd: 1(-1,0) 2(1,0)
RELAY-TH_HF49FD-XXX-1H12-XXX
  round 1.8 hole 1.2: 1(-8.89,0) 2(-6.35,0)
  round 2 hole 1.4: 3(1.27,0) 4(8.89,0)
RJ45-TH_HR911105A
  rect 1.6x1.6 hole 1: 1(-4.45,4.355)
  round 1.6 hole 1: 2(-3.18,6.895) 3(-1.91,4.355) 4(-0.64,6.895) 5(0.63,4.355) 6(1.9,6.895) 7(3.17,4.355) 8(4.44,6.895)
  round 1.8 hole 1.1: 9(-6.625,-6.895) 10(-4.085,-6.895) 11(4.085,-6.895) 12(6.625,-6.895)
  round 2.5 hole 1.8: SH1(-7.745,1.055) SH2(7.745,1.055)
SENSOR-TH_MP-5
  rect 1.8x1.8 hole 1.2: 1(-1.549,-1.55)
  round 1.8 hole 1.2: 2(1.55,-1.55) 3(-1.55,1.55) 4(1.55,1.55)
SOIC-8_L4.9-W3.9-P1.27-LS6.0-BL
  oval 0.588x2.045 smd: 1(-1.905,-2.772) 2(-0.635,-2.772) 3(0.635,-2.772) 4(1.905,-2.772) 5(1.905,2.772) 6(0.635,2.772) 7(-0.635,2.772) 8(-1.905,2.772)
SOIC-16_L9.9-W3.9-P1.27-LS6.0-BL
  oval 0.602x1.971 smd: 1(-4.445,-2.736) 2(-3.175,-2.736) 3(-1.905,-2.736) 4(-0.635,-2.736) 5(0.635,-2.736) 6(1.905,-2.736) 7(3.175,-2.736) 8(4.445,-2.736) 9(4.445,2.736) 10(3.175,2.736) 11(1.905,2.736) 12(0.635,2.736) 13(-0.635,2.736) 14(-1.905,2.736) 15(-3.175,2.736) 16(-4.445,2.736)
SOP-8_L5.0-W4.0-P1.27-LS6.0-BL
  oval 0.574x2.035 smd: 1(-1.905,-2.768) 2(-0.635,-2.768) 3(0.635,-2.768) 4(1.905,-2.768) 5(1.905,2.768) 6(0.635,2.768) 7(-0.635,2.768) 8(-1.905,2.768)
SOT-223-3_L6.5-W3.4-P2.30-LS7.0-BR
  rect 2.5x1.1 smd: 1(2.97,-2.3) 2(2.97,0) 3(2.97,2.3)
  rect 2.34x3.6 smd: 4(-2.97,0)
SOT-223-4_L6.5-W3.5-P2.30-LS7.0-BR
  rect 2.47x0.98 smd: 1(2.835,-2.3) 2(2.835,0) 3(2.835,2.3)
  rect 2.47x3.6 smd: 4(-2.835,0)
SOT_PDS
  rect 0.6x1 smd: 1(0,0) 2(0.95,0) 3(1.9,0) 4(1.9,2.59) 5(0,2.59)
TH_KF128L-5.08-2P
  round 2.4 hole 1.6: 1(-2.54,0) 2(2.54,0)

## Nets
As in the schematic, except:
3V3: C1.1 C2.1 C3.1 C4.1 C5.1 C6.1 C7.1 C8.1 C9.1 C18.1 C20.1 C22.1 C23.1 C26.1 C27.1 C29.1 C30.1 C31.1 C32.1 C37.2 C38.2 H1.2 H2.10 J2.4 J2.5 OLED1.2 R3.2 R5.2 R6.2 R7.2 R8.2 R9.2 R11.2 R14.2 R15.1 R17.2 R18.1 R19.2 R23.1 U1.2 U1.12 U1.17 U1.21 U1.29 U1.40 U1.42 U1.45 U1.64 U5.2 U5.4 U6.3 U7.1 U7.9 U7.24 U7.36 U7.48 U10.8 U11.8 U12.3
GND: C1.2 C2.2 C3.2 C4.2 C5.2 C6.2 C7.2 C8.2 C9.2 C10.2 C11.2 C12.2 C13.2 C14.2 C15.2 C16.1 C17.1 C18.2 C19.2 C20.2 C21.2 C22.2 C23.2 C24.2 C25.2 C26.2 C27.2 C28.2 C29.2 C30.2 C31.2 C32.2 C33.1 C34.1 C35.2 C36.2 C37.1 C38.1 C39.2 C40.1 C41.2 C42.1 DC1.2 DC1.3 H1.3 H2.9 OLED1.1 R1.2 R2.2 R4.2 R10.1 R16.2 R20.1 R22.2 TP2.1 TP3.1 TP4.1 TP5.1 U1.3 U1.9 U1.13 U1.18 U1.20 U1.37 U1.41 U1.44 U1.48 U5.1 U6.1 U7.8 U7.23 U7.35 U7.47 U9.8 U10.1 U10.2 U10.3 U10.4 U10.7 U11.5 U12.2 U13.2
M_SCL: OLED1.3 R15.2 U7.42 U10.6
M_SDA: OLED1.4 R14.1 U7.43 U10.5

Pads without a net: J2 7; U1 14 15 16 22 23 24 25 26 27 30 31 32 33 34 35 38 39 46 47 50 51 53 55 56 57; U7 2 3 4 39 40 41 45 46; U13 5

## Via types
v1: diameter 0.66, hole 0.406, Top Layer to Bottom Layer, 198 vias

## Routing (per net, layer and track width the routed paths; a pad name or vN(x,y) marks a point on that pad's centre or on a via; arc(x,y) is an arc through that point)
1V8: length 95.7
  Top Layer w0.254: 50.29,15.11 50.29,15.88 49.72,16.45 48.66,16.45 ; 40.79,15.93 U1.6 ; 40.79,15.93 U1.63 ; 40.79,15.93 40.79,18.61 ; 38.97,20.43 40.79,22.25 U1.43 ; 38.97,20.43 40.79,18.61 ; 38.97,20.43 U1.54 32.66,20.43 31.62,21.46 31.62,22.61 ; 40.79,18.61 42.48,18.61 ; U1.28 44.8,20.93 42.48,18.61 ; 42.48,18.61 44.66,16.43 U1.19 ; 33.91,15.88 33.98,15.95 35.38,15.95
  Top Layer w0.508: v1(31.62,24.64) 31.62,22.99 ; 35.18,40.51 37.72,40.51
  Top Layer w0.762: 19.7,40.49 18.27,40.49 17.42,39.64 C11.1 C12.1 ; 19.7,40.49 C24.1 ; 19.7,40.49 v1(19.7,42.55) ; 19.7,40.49 C25.1 29.15,40.49 29.17,40.51 U6.2
  Bottom Layer w0.762: v1(31.62,24.64) 31.62,25.78 19.58,37.83 19.58,42.42 v1(19.7,42.55)
3V3: length 390.2
  Top Layer w0.254: v1(52.96,32.13) 51.86,31.03 U7.1 50.04,31.03 49.49,30.48 U7.48 ; 42.42,27.18 42.29,27.05 42.29,25.78 ; 42.42,27.18 v1(41.15,27.18) ; 42.42,27.18 C9.1 ; v1(34.93,25.78) 35.85,26.71 39.79,26.71 ; v1(41.15,27.18) 40.26,27.18 39.79,26.71 ; v1(41.15,27.18) 41.29,27.04 U1.42 ; 35.69,13.72 36.32,14.35 36.32,15.37 ; U1.45 39.79,26.71 ; 48.76,21.46 49.4,21.46 49.66,21.21 ; 46.35,11.94 46.23,11.81 ; 46.23,11.81 46.35,11.81 48.64,9.53 49.66,9.53 ; 46.23,11.81 46.1,11.68 44.07,11.68 43.79,11.97 U1.12 ; U7.36 41.45,31.03 41.02,30.61 v1(41.02,30.1) ; 50.04,20.7 50.42,20.32 50.42,17.53 ; U1.2 38.79,14.81 38.17,15.43 U1.64 ; R11.2 62.1,17.53 v1(60.07,15.49) ; 46.36,15.43 46.36,11.94 ; 46.36,15.43 45.53,15.43 v1(45.34,15.62) ; 46.36,15.43 U1.17 ; v1(45.47,22.1) 46.14,21.43 U1.29 ; 35.43,13.46 30.23,13.46 27.81,15.88 24.01,15.88 23.97,15.91 ; U7.9 52.18,35.03 v1(53.85,36.7) ; 32.51,34.62 R17.2 ; v1(40.13,38.61) 43.18,38.61 43.76,38.03 U7.24 ; 49.78,17.4 48.73,17.4 ; 51.18,28.96 51.18,30.99 ; 48.01,15.37 48.01,14.1 48.13,13.97
  Top Layer w0.508: U11.8 18.36,30.43 17.65,29.71 ; v1(32.89,25.78) 31.24,25.78 28.83,28.19 v1(26.54,28.19) ; 50.55,17.53 52.58,15.49 52.58,13.21 54.99,10.79 56.64,12.45 56.64,16 58.04,17.4 ; R19.2 17.47,35.18 v1(19.69,35.18) 20.57,36.07 32.26,36.07 32.51,35.81 32.51,34.62 33.71,34.62 35.18,33.15 35.18,30.86 33.86,29.54 R18.1 ; U10.8 45.59,48.5 42.8,48.5 41.21,50.09 41.21,50.1 ; 17.65,29.71 C38.2 14.41,28.14 13.7,27.43 R6.2 ; 17.65,29.71 17.65,29.73 v1(16.76,30.61) ; R23.1 53.48,44.32 v1(55.37,44.32)
  Top Layer w0.762: U5.2 U5.4 29.66,48.41 C20.1 18.91,44.49 18.95,44.45 ; R14.2 R15.1 55.1,20.47 v1(60.07,15.49) ; R23.1 52.05,45.72 v1(45.47,45.72) ; 26.38,43.43 27.56,43.43 29.72,45.59 34.5,45.59 ; 26.38,43.43 22.73,43.43 21.72,44.45 18.95,44.45 ; 26.38,43.43 26.4,43.46 ; 55.25,26.16 55.12,26.03 55.12,23.88 ; 34.84,45.6 U6.3 ; C27.1 22.61,23.24 22.1,22.73 22.1,18.84 J2.4 18.62,15.37 J2.5 ; C27.1 24.02,20.4 R9.2 R8.2 R5.2 R3.2 23.97,8.76 ; C27.1 24.08,23.3 C26.1 24.08,28.17 24.06,28.19 ; 24.06,28.19 v1(26.54,28.19) ; 24.06,28.19 17.7,28.19 C38.2 ; H2.10 65.02,3.68 64.39,3.05 64.39,1.97 63.56,1.14 59.42,1.14 59.44,1.16 H1.2 59.44,8.89 v1(61.72,11.18) ; v1(17.02,44.45) 18.95,44.45 ; 44.73,58 44.73,53.62 v1(37.21,46.1)
  Bottom Layer w0.254: v1(41.02,30.1) 41.02,27.31 v1(41.15,27.18) 42.29,26.03 42.93,26.03 45.47,23.5 v1(45.47,22.1) 45.34,21.97 v1(45.34,15.62) ; v1(52.96,32.13) 52.96,35.81 v1(53.85,36.7)
  Bottom Layer w0.508: v1(41.02,30.1) 40.26,30.1 39.5,30.86 39.5,32 40.13,32.64 v1(40.13,38.61) ; v1(19.69,35.18) 16.76,32.26 v1(16.76,30.61) ; v1(32.89,25.78) v1(34.93,25.78) ; v1(55.37,44.32) 55.37,39.75 53.97,38.35 53.97,36.83 v1(53.85,36.7)
  Bottom Layer w0.762: v1(60.07,15.49) 61.72,13.84 v1(61.72,11.18) ; v1(26.54,28.19) 17.02,37.72 v1(17.02,44.45) 35.56,44.45 v1(37.21,46.1) 37.59,45.72 v1(45.47,45.72)
GND: length 127.4
  Top Layer w0.254: U1.48 38.29,23.56 39.12,22.73 v1(40,22.73) 40.29,23.02 U1.44 ; v1(55.12,18.29) 54.48,17.65 52.45,17.65 ; U1.37 43.79,23.85 v1(42.93,22.99) 42.16,22.99 41.79,23.36 U1.41 ; U7.8 52.69,34.53 55.21,37.05 C34.1 ; U1.18 48.97,15.93 49.53,15.37 49.53,14.1 50.04,13.59 ; U1.20 45.68,16.93 v1(44.2,18.42) ; 47.24,8.89 47.24,9.27 v1(46.23,10.29) 45.59,10.92 v1(45.34,10.92) ; 52.32,19.18 51.82,19.69 51.82,21.04 50.04,22.81 50.04,22.99 49.4,22.99 45.21,27.18 44.83,27.18 ; 52.32,19.18 52.32,17.91 ; 52.32,19.18 52.96,19.81 v1(53.21,19.81) ; C16.1 39.29,9.16 U1.3 ; v1(40.51,31.24) 40.8,31.53 U7.35 ; 30.1,20.45 31.12,20.45 v1(32,19.56) ; U1.9 42.29,14.6 v1(43.43,15.75) 44.29,14.89 U1.13 ; U7.23 v1(44.49,39.62) ; 38.74,28.96 39.5,28.96 v1(40,28.45) 40.13,28.32 43.94,28.32 44.83,27.43 ; v1(32.13,17.65) 31.37,16.89 31.37,16 ; C33.1 54.02,27.56 50.08,27.56 48.99,28.66 U7.47
  Top Layer w0.508: v1(34.8,36.7) 34.84,36.74 34.84,38.21 ; R16.2 v1(34.04,32.05) ; C16.1 38.61,8.49 v1(38.61,7.24) v1(38.61,5.97) v1(38.61,4.7) v1(38.61,3.43) v1(38.61,2.16) v1(39.9,2.16) v1(41.18,2.16) v1(42.47,2.16) v1(43.76,2.16) v1(45.05,2.16) v1(46.34,2.16) v1(47.62,2.16) v1(47.62,3.39) v1(47.62,4.62) v1(47.62,5.85) v1(47.62,7.08) 47.62,8.53 47.24,8.91 C17.1 ; C34.1 55.7,37.34 v1(57.84,37.34) v1(59.07,37.34) v1(60.29,37.34) v1(61.51,37.34) v1(62.74,37.34) v1(62.74,36.09) v1(62.74,34.85) v1(62.74,33.61) v1(62.74,32.36) v1(62.74,31.12) v1(62.74,29.88) v1(62.74,28.64) v1(61.48,28.64) v1(60.23,28.64) v1(58.97,28.64) v1(57.72,28.64) 55.73,28.64 C33.1
  Bottom Layer w0.254: v1(44.49,39.62) 44.58,39.62
  vias: v1(3.97,25.84) v1(3.97,24.96) v1(4.83,25.84) v1(4.83,24.96) v1(5.68,25.84) v1(5.68,24.96) v1(6.51,6.79) v1(6.51,5.91) v1(7.37,6.79) v1(7.37,5.91) v1(8.22,6.79) v1(8.22,5.91) v1(12.61,37.27) v1(12.61,36.39) v1(13.46,37.27) v1(13.46,36.39) v1(14.13,56.96) v1(14.13,56.07) v1(14.31,37.27) v1(14.31,36.39) v1(14.99,56.96) v1(14.99,56.07) v1(15.56,47.72) v1(15.56,46.86) v1(15.56,46.01) v1(15.84,56.96) v1(15.84,56.07) v1(16.45,47.72) v1(16.45,46.86) v1(16.45,46.01) v1(23.4,51.75) v1(23.4,50.86) v1(24.26,51.75) v1(24.26,50.86) v1(25.11,51.75) v1(25.11,50.86) v1(28.26,26.25) v1(28.26,25.4) v1(28.26,24.55) v1(28.36,9.97) v1(28.36,9.08) v1(29.15,26.25) v1(29.15,25.4) v1(29.15,24.55) v1(29.21,9.97) v1(29.21,9.08) v1(30.06,9.97) v1(30.06,9.08) v1(31.15,9.97) v1(31.15,9.08) v1(32,9.97) v1(32,9.08) v1(32.86,9.97) v1(32.86,9.08) v1(39.24,10.79) v1(50.29,11.3) v1(57.57,45.28) v1(57.57,44.39) v1(58.42,45.28) v1(58.42,44.39) v1(59.27,45.28) v1(59.27,44.39) v1(76.52,12.03) v1(76.52,11.18) v1(76.52,10.32) v1(77.41,12.03) v1(77.41,11.18) v1(77.41,10.32)
PGND: length 20.7
  Top Layer w1.27: TP1.1 14.06,3.18 J2.SH2 J2.SH1
BOOT0: length 4.5
  Top Layer w0.254: 47.5,28.96 47.5,28.58 48.26,27.81 48.73,27.81 50.12,26.42 50.67,26.42
DC: length 115.2
  Top Layer w0.508: 61.2,42.29 C41.1 ; 61.2,42.29 U13.3 ; 61.2,42.29 63.84,42.29 63.88,42.32 ; U9.9 v1(63.88,47.5)
  Top Layer w0.762: 65.15,39.12 65.15,19.94 K4.1 K3.1 ; 65.15,39.12 K2.1 K1.1 ; 65.15,39.12 63.88,40.39 v1(63.88,47.5) ; 34.78,57.02 36.32,57.02 38.1,55.25 38.1,52.82 C36.1 40.03,52.81 v1(40.77,52.07)
  Top Layer w1.016: C35.1 34.78,57.02 28.07,57.02 27.42,56.37 U5.3 27.39,54.38 24.42,54.38 ; DC1.4 13.63,52.36 15.64,54.38 C21.1 24.42,54.38 ; 24.42,54.38 C19.1
  Bottom Layer w0.762: v1(63.88,47.5) 59.31,52.07 v1(40.77,52.07)
ETH_CS: length 31.4
  Top Layer w0.254: v1(33.66,17.53) 34.06,17.93 U1.59 ; v1(38.23,38.86) 38.48,38.86 40.81,36.53 U7.25
  Bottom Layer w0.254: v1(38.23,38.86) 35.69,36.32 35.69,19.56 v1(33.66,17.53) 33.53,17.53
ETH_INT#: length 17.2
  Top Layer w0.254: U1.49 34.6,22.93 34.16,23.37 34.16,27.81 39.38,33.03 U7.32
ETH_RSTI: length 25.4
  Top Layer w0.254: v1(44.2,21.72) 44.29,21.81 U1.36 ; v1(38.48,34.8) 38.75,34.53 U7.29
  Bottom Layer w0.254: v1(44.2,21.72) 39.75,21.72 38.48,22.99 v1(38.48,34.8)
ETH_SCK: length 29
  Top Layer w0.254: v1(38.1,37.72) 38.74,37.72 40.42,36.03 U7.26 ; v1(38.35,18.67) 38.35,17.65 38.13,17.43 U1.60
  Bottom Layer w0.254: v1(38.1,37.72) 36.19,35.81 36.19,20.83 v1(38.35,18.67)
ETH_SDI: length 28.8
  Top Layer w0.254: v1(37.85,36.45) 39.26,35.03 U7.28 ; U1.61 38.77,16.93 39.12,17.27 v1(39.12,17.91)
  Bottom Layer w0.254: v1(37.85,36.45) 36.7,35.31 36.7,21.59 39.12,19.18 v1(39.12,17.91)
ETH_SDO: length 29
  Top Layer w0.254: U1.62 39.54,16.43 39.88,16.76 v1(39.88,18.54) ; U7.27 39.78,35.53 v1(38.99,36.32)
  Bottom Layer w0.254: v1(38.99,36.32) 37.21,34.54 37.21,22.22 39.88,19.56 v1(39.88,18.54)
K11: length 11.6
  Top Layer w0.762: CN1.1 82.3,49.28 K1.3
K12: length 12.6
  Top Layer w0.762: K1.4 78.49,52.2 CN1.2
K21: length 24
  Top Layer w0.762: CN2.1 83.65,35.6 81.03,38.23 81.03,40.26 76.45,44.83 71.75,44.83 K2.3
K22: length 26.5
  Top Layer w0.762: K2.4 71.25,52.96 71.25,48.51 72.9,46.86 78.27,46.86 CN2.2
K31: length 12.3
  Top Layer w0.762: K3.3 80.6,27.94 CN3.1
K32: length 13.3
  Top Layer w0.762: CN3.2 80.86,32.77 76.58,32.77 K3.4
K41: length 23.5
  Top Layer w0.762: K4.3 72.14,23.11 73.91,23.11 CN4.1
K42: length 26.9
  Top Layer w0.762: K4.4 67.31,31.5 73.28,25.53 76.58,25.53 CN4.2
LINK#: length 40.3
  Top Layer w0.254: U1.52 33.69,21.43 33.27,21.84 v1(33.27,21.97)
  Top Layer w0.508: J2.10 J2.11
  Bottom Layer w0.254: v1(33.27,21.97) 15.75,21.97 12.83,19.06 7.13,19.06 J2.10
M_C: length 32
  Top Layer w0.254: v1(42.16,30.1) 43.28,30.1 43.57,30.39 43.57,31.72 43.26,32.03 U7.34 ; v1(52.12,8.89) 52.32,8.69 52.32,6.35
  Bottom Layer w0.254: v1(52.12,8.89) 52.12,18.63 42.16,28.59 v1(42.16,30.1)
M_D: length 36
  Top Layer w0.254: v1(62.08,8.76) 64.12,8.76 R12.2 ; 43.94,29.59 43.56,29.59 v1(43.05,29.08)
  Bottom Layer w0.254: v1(62.08,8.76) 54.23,8.76 52.71,10.29 52.71,19.39 52.55,19.54 52.55,19.58 v1(43.05,29.08)
M_DIR: length 23
  Top Layer w0.254: U7.33 39.9,32.53 v1(34.93,27.56)
  Top Layer w0.508: R16.1 30.1,31.7 v1(28.42,31.7) U11.2 U11.3
  Bottom Layer w0.254: v1(28.42,31.7) 28.47,31.75 30.73,31.75 v1(34.93,27.56)
M_IO_PA4: length 51.6
  Top Layer w0.254: U7.14 48.99,39.15 v1(48.01,40.13)
  Bottom Layer w0.254: v1(48.01,40.13) 48.01,35.26 49.3,33.97 49.3,33.2 73.49,9.02 76.96,9.02 H2.1
M_IO_PA5: length 44.8
  Top Layer w0.254: v1(48.51,33.66) 48.51,34.67 48.49,34.7 U7.15
  Bottom Layer w0.254: v1(48.51,33.66) 48.51,33.15 73.41,8.25 75.18,8.25 H2.3
M_IO_PA6: length 43.2
  Top Layer w0.254: v1(47.62,34.16) 47.99,34.52 U7.16
  Bottom Layer w0.254: v1(47.62,34.16) 47.62,33.27 H2.5
M_IO_PA7: length 42.5
  Top Layer w0.254: U7.17 47.49,35.67 v1(46.86,35.05)
  Bottom Layer w0.254: H2.7 72.14,8 46.86,33.27 v1(46.86,35.05)
M_IO_PB1: length 59.9
  Top Layer w0.254: v1(46.1,35.69) 46.49,36.07 U7.19 ; v1(67.18,0.76) 76.84,0.76 H2.2
  Bottom Layer w0.254: v1(67.18,0.76) 67.18,12.19 46.1,33.27 v1(46.1,35.69)
M_IO_PB2: length 61.2
  Top Layer w0.254: H2.4 75.06,1.52 v1(66.29,1.52) ; U7.20 45.99,39.36 v1(45.34,40)
  Bottom Layer w0.254: v1(45.34,40) 45.34,33.27 66.29,12.32 v1(66.29,1.52)
M_IO_PB10: length 54.3
  Top Layer w0.254: H2.6 73.41,2.41 v1(65.53,2.41) ; v1(44.58,35.56) 45.49,36.47 U7.21
  Bottom Layer w0.254: v1(65.53,2.41) 65.53,12.32 44.58,33.27 v1(44.58,35.56)
M_IO_PB11: length 48
  Top Layer w0.254: v1(43.81,36.32) 44.58,36.32 44.99,36.73 U7.22 ; v1(64.74,11.48) 64.74,11.07 68.42,7.4 70.09,7.4 70.78,6.71 70.78,5.04 H2.8
  Bottom Layer w0.254: v1(43.81,36.32) 43.81,33.27 64.74,12.34 v1(64.74,11.48)
M_K1: length 26.9
  Top Layer w0.254: U7.10 49.69,35.53 49.15,36.07 v1(49.15,36.45)
  Top Layer w0.508: v1(52.07,49.66) 52.07,53.97 53.21,55.12 U9.2 U9.1
  Bottom Layer w0.254: v1(49.15,36.45) 49.15,38.48 52.07,41.4 v1(52.07,49.66)
M_K2: length 22.2
  Top Layer w0.254: v1(53.09,38.35) 53.09,36.96 52.16,36.03 U7.11
  Top Layer w0.508: v1(52.96,50.55) 52.96,51.94 53.59,52.58 U9.4 U9.3
  Bottom Layer w0.254: v1(52.96,50.55) 53.09,50.42 v1(53.09,38.35)
M_K3: length 18.9
  Top Layer w0.254: U7.12 51.9,36.53 52.17,36.8 52.17,38.71 53.47,40 v1(53.97,40)
  Top Layer w0.508: v1(53.97,50.04) U9.6 U9.5
  Bottom Layer w0.254: v1(53.97,40) v1(53.97,50.04)
M_K4: length 16.2
  Top Layer w0.254: U7.13 49.49,39.83 v1(49.91,40.26)
  Top Layer w0.508: v1(51.31,48.77) U9.7
  Bottom Layer w0.254: v1(49.91,40.26) 51.31,41.66 v1(51.31,48.77)
M_KC1: length 21.5
  Top Layer w0.508: v1(64.39,55.12) U9.15 U9.16
  Bottom Layer w0.508: v1(64.39,55.12) 73.79,45.72 K1.2
M_KC2: length 16
  Top Layer w0.508: U9.14 U9.13 64.01,52.58 65.28,51.31 65.28,43.69 K2.2
M_KC3: length 37.4
  Top Layer w0.508: U9.12 U9.11 v1(63.88,50.04)
  Bottom Layer w0.508: v1(63.88,50.04) 71.75,42.16 71.75,22.35 K3.2
M_KC4: length 34.5
  Top Layer w0.508: U9.10 v1(58.93,48.77)
  Bottom Layer w0.508: K4.2 64.64,22.99 64.64,43.05 v1(58.93,48.77)
M_RST#: length 23.5
  Top Layer w0.254: v1(60.96,22.48) 59.94,22.48 59.67,22.21 C28.1 61.96,20.83 R11.1 ; v1(53.85,34.67) 53.21,34.03 U7.7
  Bottom Layer w0.254: v1(53.85,34.67) 53.85,29.59 v1(60.96,22.48)
M_RXD: length 19
  Top Layer w0.254: R18.2 31.92,28.07 33.53,28.07 38.99,33.53 U7.31
  Top Layer w0.508: U11.1 29.56,30.43 R18.2
M_SCL: length 51.3
  Top Layer w0.254: R15.2 51.69,22.88 v1(51.69,22.99) ; U7.42 46.49,28.66 46.52,28.62 46.52,27.77 46.99,27.31 v1(46.99,26.67)
  Top Layer w0.508: 47.88,58.29 48.13,58.04 v1(48.13,50.47) U10.6
  Bottom Layer w0.254: v1(48.13,50.47) 48.13,46.74 44.58,43.18 42.54,43.18 41.53,42.16 41.53,32.13 v1(46.99,26.67) 50.67,22.99 v1(51.69,22.99)
M_SDA: length 50.1
  Top Layer w0.254: U7.43 46.99,29.53 46.99,28.19 v1(48.64,26.54) 51.22,23.96 52.97,23.96 R14.1
  Top Layer w0.508: 50.42,58.29 49.4,57.28 v1(49.4,50.45) U10.5
  Bottom Layer w0.254: v1(48.64,26.54) 42.29,32.89 42.29,41.4 43.18,42.29 45.09,42.29 49.4,46.61 v1(49.4,50.45)
M_TXD: length 18.8
  Top Layer w0.254: v1(34.8,35.43) 36.2,34.03 U7.30
  Top Layer w0.508: R17.1 30.13,34.24 v1(28.57,34.24) U11.4
  Bottom Layer w0.254: v1(34.8,35.43) 29.76,35.43 v1(28.57,34.24)
M_X1: length 9.5
  Top Layer w0.254: U8.2 C33.2 53.33,33.03 U7.5
M_X2: length 9.3
  Top Layer w0.254: U8.1 C34.2 53.89,33.53 U7.6
RXN: length 24.6
  Top Layer w0.254: R3.1 26,11.68 v1(27.69,11.68) ; v1(40,11.81) 40.29,12.09 U1.5
  Bottom Layer w0.254: v1(40,11.81) 39.88,11.68 v1(27.69,11.68) 25.27,14.1 J2.6
RXP: length 27.3
  Top Layer w0.254: v1(39.62,15.11) 39.79,14.95 U1.4 ; R5.1 26.02,14.61 v1(27.69,14.61)
  Bottom Layer w0.254: J2.3 24.38,17.91 v1(27.69,14.61) 39.12,14.61 v1(39.62,15.11)
S_CTRL: length 20.7
  Top Layer w0.254: U7.38 44.49,30.64 45.34,31.5 48.01,31.5 49.53,33.02 v1(49.53,34.67) ; v1(52.07,39.62) 53.47,41.02 R23.2
  Top Layer w0.508: U13.4 53.49,42.29 R23.2
  Bottom Layer w0.254: v1(49.53,34.67) 52.07,37.21 v1(52.07,39.62)
SEN_OUT: length 42.2
  Top Layer w0.254: v1(44.67,40.92) 45.94,40.92 46.99,39.88 46.99,38.04 U7.18 ; 44.58,41.02 43.31,42.29 39.37,42.29
  Bottom Layer w0.254: v1(44.67,40.92) 43.05,39.31 43.05,33.15 54.08,22.12 54.08,14.89 54.48,14.48
TXN: length 28.2
  Top Layer w0.254: v1(27.69,17.53) 26.04,17.53 R8.1 ; v1(42.29,15.88) 41.79,15.37 U1.8
  Bottom Layer w0.254: v1(42.29,15.88) 29.34,15.88 v1(27.69,17.53) 26.03,19.18 J2.2
TXP: length 31
  Top Layer w0.254: R9.1 v1(27.69,20.36) ; v1(41.66,16.64) 41.29,16.27 U1.7
  Bottom Layer w0.254: J2.1 17.36,20.45 27.69,20.45 v1(27.69,20.36) 31.41,16.64 v1(41.66,16.64)
V_HU: length 38
  Top Layer w0.508: U13.1 58.67,38.99 59.18,38.48 63.25,38.48 63.88,37.85 63.88,27.86 C40.2 62.59,26.51 C42.2 63.12,24.13 64.01,23.24 64.01,17.01 58.43,11.43 57.71,11.43 57.68,11.41
XI: length 9.1
  Top Layer w0.254: U1.10 42.79,11.54 41.09,9.85 C16.2 X1.2
XO: length 9.2
  Top Layer w0.254: X1.1 C17.2 45.19,9.68 43.29,11.58 U1.11
$1N6890: length 6
  Top Layer w0.254: R4.1 35.48,8.81 38.29,11.62 U1.1
$1N7627: length 6.3
  Top Layer w0.254: U1.58 29.98,18.43 29.97,18.42
$1N10654: length 6
  Top Layer w0.254: R2.1 18.29,9.95 J2.8
$1N10919: length 22.4
  Top Layer w0.254: R7.1 24.07,6.48 v1(25.53,6.48)
  Bottom Layer w0.254: v1(25.53,6.48) 25.4,6.35 11.05,6.35 8.02,9.38 J2.12
$1N10952: length 7.2
  Top Layer w0.508: J2.9 7.91,22.62 R6.1
$2N5291: length 4
  Top Layer w0.254: 62.23,3.56 62.23,3.81 64.13,5.72 R12.1
$2N5344: length 2.6
  Top Layer w0.254: 54.36,6.17 54.36,3.56 H1.4
$2N14954: length 17.6
  Top Layer w0.508: 21.57,31.7 12.64,31.7 12.57,31.77 10.18,31.77 7.87,29.46 5,29.46 CN5.2
$2N14989: length 17.4
  Top Layer w0.508: 21.57,32.97 15.55,32.97 14.86,33.66 12.68,33.66 ; 12.68,33.66 9.27,33.66 8.38,34.54 5,34.54 CN5.1 ; 12.68,33.66 12.57,33.77

## Copper pours and planes (outline as drawn; the poured copper is in the pictures)
GND on Top Layer: -1.27,61.47 91.44,61.47 91.44,-1.65 -1.27,-1.65
GND on Bottom Layer: -1.52,62.1 91.44,62.1 91.44,-2.41 -1.52,-2.41

Small or netless copper shapes (teardrops, artwork), in the pictures only: 485 on Top Layer, 99 on Bottom Layer
